# Altium project BC2087.PrjPcb (part 1 of 5)
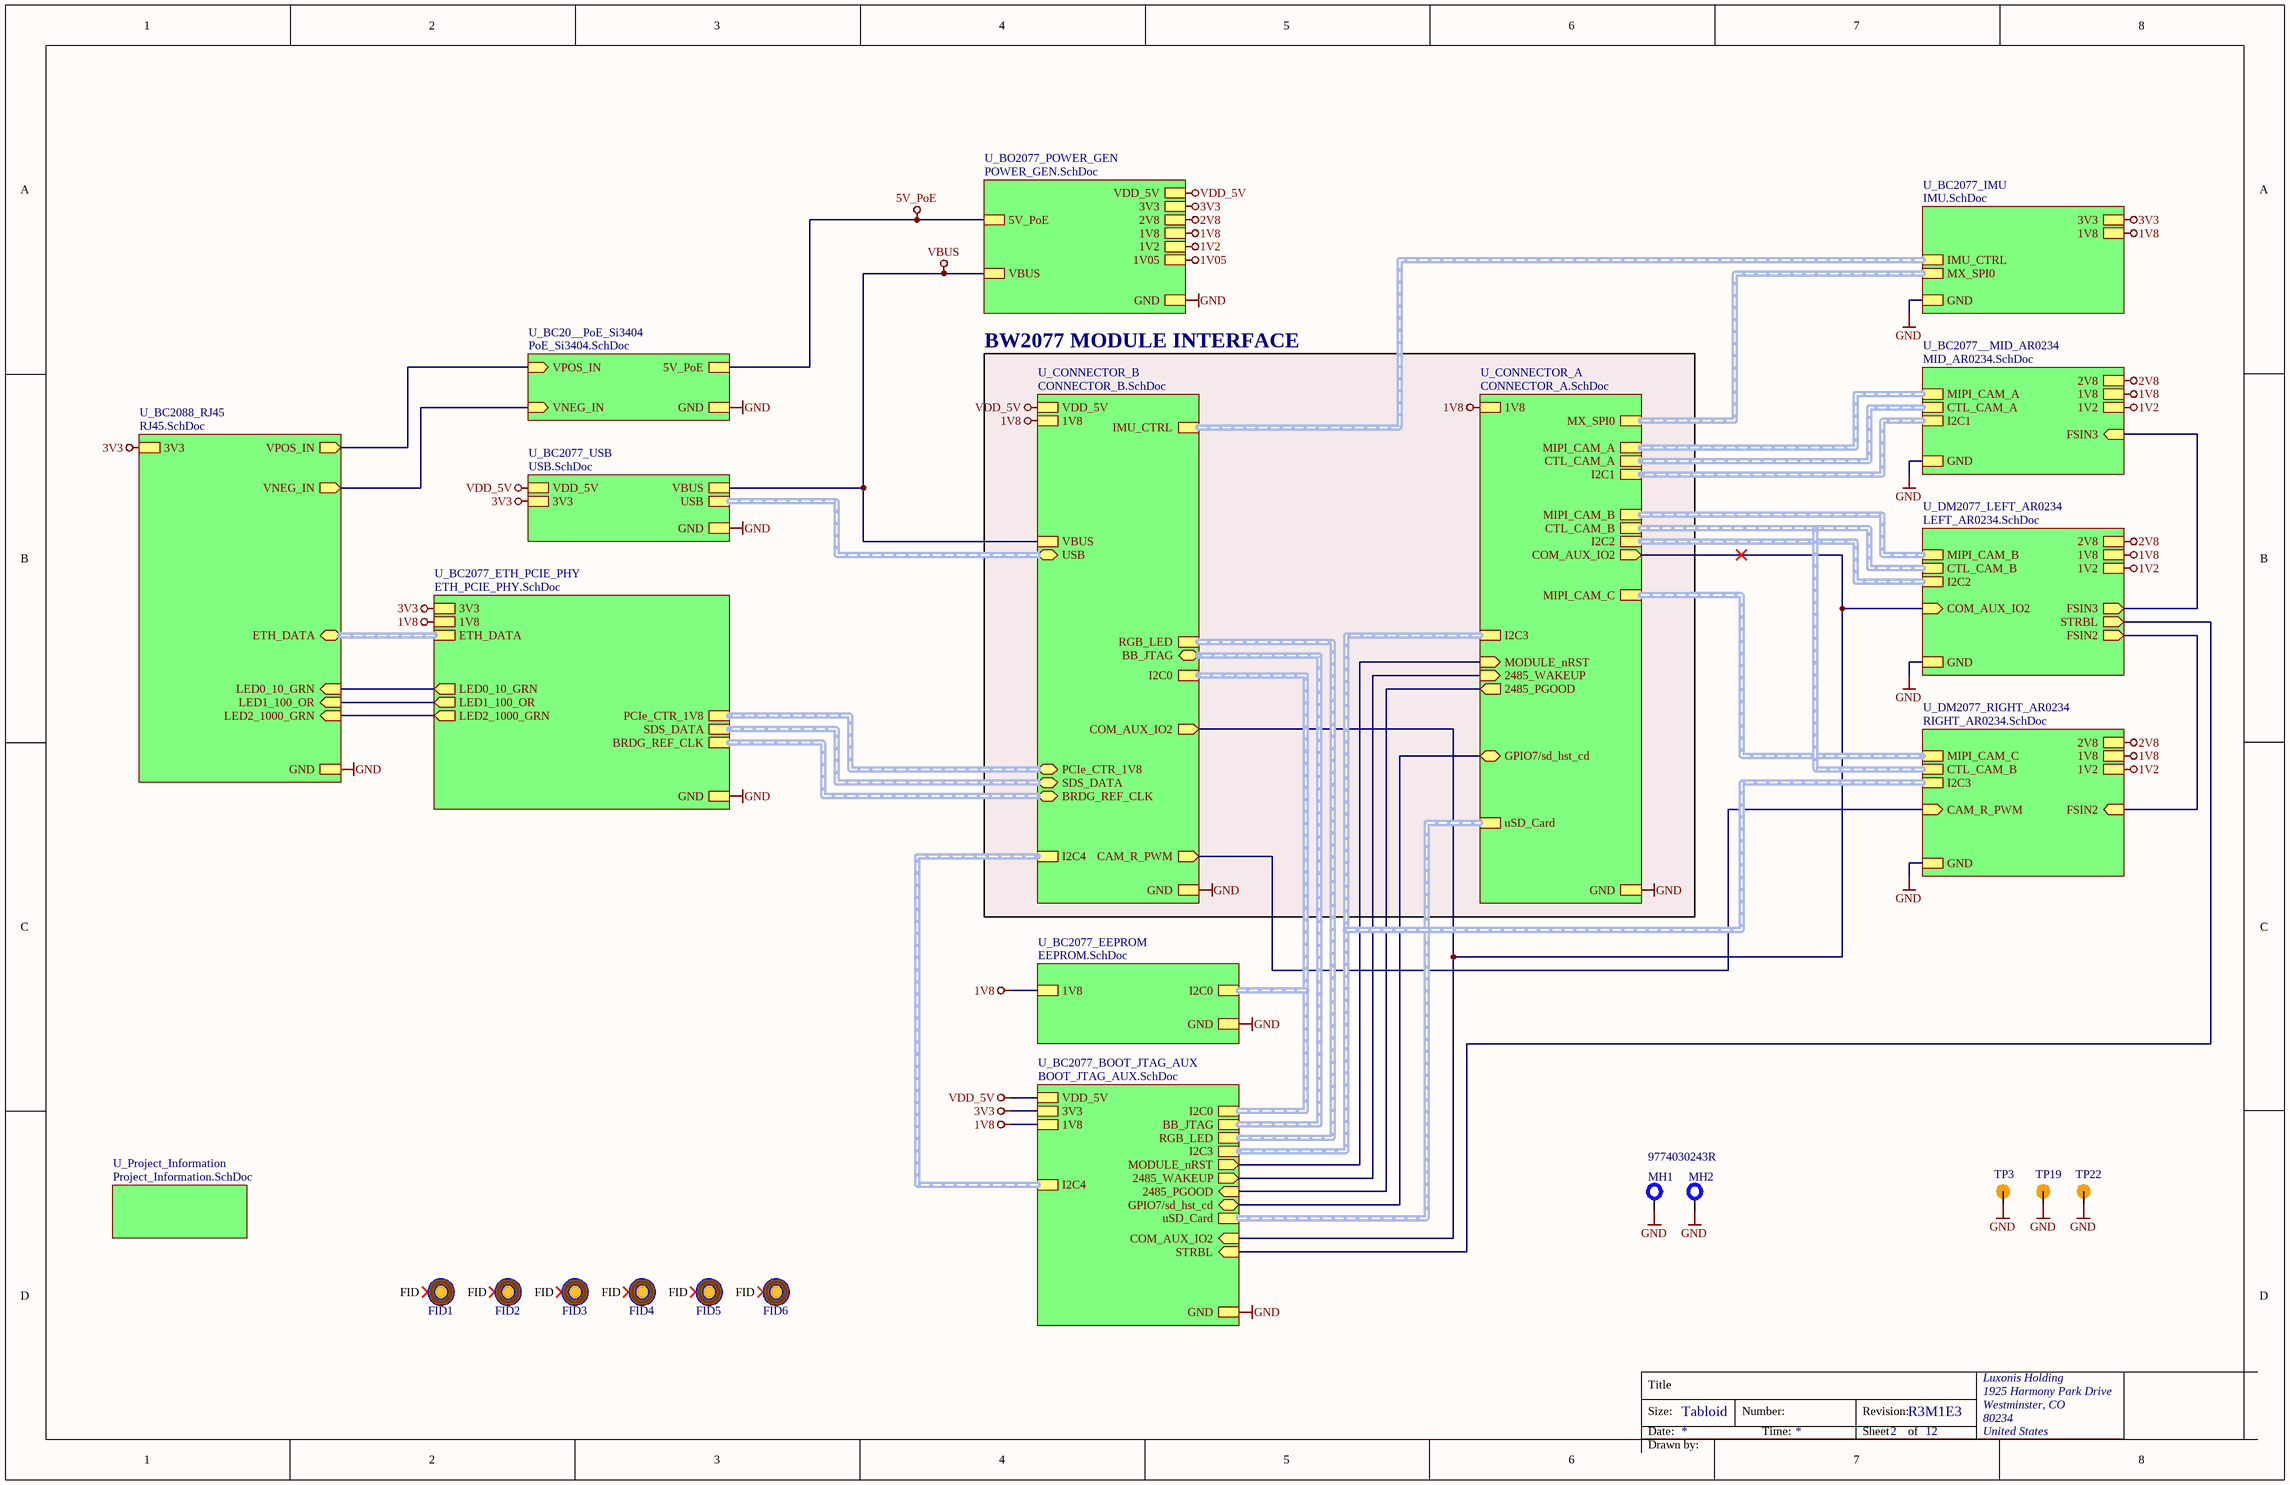
[diagram p0: TopLevel.SchDoc]
document_number: D2088000; drawn_by: Boris Chou / Blaz Kvas; project_title: BC2087; revision: R3M1E3
15 sheets, 302 parts. Net scope: strictly hierarchical (ports join the sheet entries above them; power ports are local).
Board file: BC2087.PcbDoc
Sheets:
  TopLevel.SchDoc
    U_Project_Information = Project_Information.SchDoc
    U_CONNECTOR_B = CONNECTOR_B.SchDoc
    U_CONNECTOR_A = CONNECTOR_A.SchDoc
    U_BC2077_ETH_PCIE_PHY = ETH_PCIE_PHY.SchDoc
    U_BC2088_RJ45 = RJ45.SchDoc
    U_BC2077_USB = USB.SchDoc
    U_BC2077_BOOT_JTAG_AUX = BOOT_JTAG_AUX.SchDoc
    U_BC20__PoE_Si3404 = PoE_Si3404.SchDoc
    U_BO2077_POWER_GEN = POWER_GEN.SchDoc
    U_BC2077__MID_AR0234 = MID_AR0234.SchDoc
    U_DM2077_RIGHT_AR0234 = RIGHT_AR0234.SchDoc
    U_DM2077_LEFT_AR0234 = LEFT_AR0234.SchDoc
    U_BC2077_IMU = IMU.SchDoc
    U_BC2077_EEPROM = EEPROM.SchDoc

## Sheet TopLevel.SchDoc: =project_title
size Tabloid; CompanyName: Luxonis Holding; DrawnBy: Boris Chou / Blaz Kvas; Organization: Luxonis Holding; Address1: 1925 Harmony Park Drive; Address2: Westminster, CO; Address3: 80234; Address4: United States; DocumentNumber: D2088000; Revision: R3M1E3; SheetNumber: 2; SheetTotal: 12

### Parts
FID1  FIDUCIAL  [FIDUCIAL_ROUND_1MM]  (value not drawn)  (no BOM)
FID2  FIDUCIAL  [FIDUCIAL_ROUND_1MM]  (value not drawn)  (no BOM)
FID3  FIDUCIAL  [FIDUCIAL_ROUND_1MM]  (value not drawn)  (no BOM)
FID4  FIDUCIAL  [FIDUCIAL_ROUND_1MM]  (value not drawn)  (no BOM)
FID5  FIDUCIAL  [FIDUCIAL_ROUND_1MM]  (value not drawn)  (no BOM)
FID6  FIDUCIAL  [FIDUCIAL_ROUND_1MM]  (value not drawn)  (no BOM)
MH1  9774030243R  [9774030243R]
MH2  9774030243R  [9774030243R]  (value not drawn)
TP3  TEST_POINT  [TP100_200_NS]  (value not drawn)  (no BOM)
TP19  TEST_POINT  [TP100_200_NS]  (value not drawn)  (no BOM)
TP22  TEST_POINT  [TP100_200_NS]  (value not drawn)  (no BOM)

### Sub-sheets
U_BC20__PoE_Si3404 = PoE_Si3404.SchDoc: 5V_PoE, GND, VPOS_IN (in), VNEG_IN (in)
U_BC2077__MID_AR0234 = MID_AR0234.SchDoc: 2V8, 1V2, I2C1 (harness I2C1), MIPI_CAM_A (harness MIPI_CAM_A), CTL_CAM_A (harness CTL_CAM_A), GND, 1V8, FSIN3 (in)
U_BC2077_BOOT_JTAG_AUX = BOOT_JTAG_AUX.SchDoc: RGB_LED (harness BOOT), BB_JTAG (harness BB_JTAG), uSD_Card (harness uSD_Card), 2485_WAKEUP (out), I2C3 (harness I2C3), MODULE_nRST (out), 2485_PGOOD (in), 1V8, 3V3, GND, VDD_5V, I2C0 (harness I2C0), GPIO7/sd_hst_cd (bidir), STRBL (in), COM_AUX_IO2 (in), I2C4 (harness I2C4)
U_BC2077_EEPROM = EEPROM.SchDoc: 1V8, GND, I2C0 (harness I2C0)
U_BC2077_ETH_PCIE_PHY = ETH_PCIE_PHY.SchDoc: ETH_DATA (harness ETH_DATA), LED0_10_GRN (out), LED1_100_OR (out), LED2_1000_GRN (out), SDS_DATA (harness Harness), 3V3, GND, BRDG_REF_CLK (harness BRDG_REF_CLK), 1V8, PCIe_CTR_1V8 (harness PCIe_CTR_1V8)
U_BC2077_IMU = IMU.SchDoc: GND, 3V3, 1V8, MX_SPI0 (harness MX_SPI0), IMU_CTRL (harness IMU_CTRL)
U_BC2077_USB = USB.SchDoc: USB (harness USB), GND, 3V3, VBUS, VDD_5V
U_BC2088_RJ45 = RJ45.SchDoc: GND, LED0_10_GRN (in), 3V3, LED2_1000_GRN (in), LED1_100_OR (in), VPOS_IN (out), VNEG_IN (out), ETH_DATA (bidir, harness ETH_DATA)
U_BO2077_POWER_GEN = POWER_GEN.SchDoc: GND, 3V3, 1V8, 5V_PoE, VBUS, 1V2, 2V8, 1V05, VDD_5V
U_CONNECTOR_A = CONNECTOR_A.SchDoc: I2C2 (harness I2C2), I2C1 (harness I2C1), uSD_Card (harness uSD_Card), MIPI_CAM_C (harness MIPI_CAM_C), CTL_CAM_A (harness CTL_CAM_A), MIPI_CAM_A (harness MIPI_CAM_A), MIPI_CAM_B (harness MIPI_CAM_B), GND, I2C3 (harness I2C3), CTL_CAM_B (harness CTL_CAM_B), COM_AUX_IO2 (out), MODULE_nRST (in), 2485_WAKEUP (in), 2485_PGOOD (out), GPIO7/sd_hst_cd (bidir), MX_SPI0 (harness MX_SPI0), 1V8
U_CONNECTOR_B = CONNECTOR_B.SchDoc: VBUS, I2C0 (harness I2C0), VDD_5V, GND, PCIe_CTR_1V8 (bidir, harness PCIe_CTR_1V8), BB_JTAG (bidir, harness BB_JTAG), USB (bidir, harness USB), SDS_DATA (bidir, harness Harness), BRDG_REF_CLK (bidir, harness BRDG_REF_CLK), IMU_CTRL (harness IMU_CTRL), RGB_LED (harness BOOT), 1V8, CAM_R_PWM (out), I2C4, COM_AUX_IO2 (out)
U_DM2077_LEFT_AR0234 = LEFT_AR0234.SchDoc: I2C2 (harness I2C2), CTL_CAM_B (harness CTL_CAM_B), MIPI_CAM_B (harness MIPI_CAM_B), 1V2, 2V8, GND, 1V8, FSIN2 (out), COM_AUX_IO2 (in), FSIN3 (out), STRBL (out)
U_DM2077_RIGHT_AR0234 = RIGHT_AR0234.SchDoc: MIPI_CAM_C (harness MIPI_CAM_C), I2C3 (harness I2C2), 1V2, 2V8, GND, 1V8, FSIN2 (in), CTL_CAM_B (harness CTL_CAM_B), CAM_R_PWM (in)
U_Project_Information = Project_Information.SchDoc: no entries

### Nets
1V2: sheet U_BO2077_POWER_GEN/1V2, sheet U_BC2077__MID_AR0234/1V2, sheet U_DM2077_RIGHT_AR0234/1V2, sheet U_DM2077_LEFT_AR0234/1V2
1V05: sheet U_BO2077_POWER_GEN/1V05
1V8: sheet U_CONNECTOR_B/1V8, sheet U_CONNECTOR_A/1V8, sheet U_BC2077_ETH_PCIE_PHY/1V8, sheet U_BC2077_BOOT_JTAG_AUX/1V8, sheet U_BO2077_POWER_GEN/1V8, sheet U_BC2077__MID_AR0234/1V8, sheet U_DM2077_RIGHT_AR0234/1V8, sheet U_DM2077_LEFT_AR0234/1V8, sheet U_BC2077_IMU/1V8, sheet U_BC2077_EEPROM/1V8
2V8: sheet U_BO2077_POWER_GEN/2V8, sheet U_BC2077__MID_AR0234/2V8, sheet U_DM2077_RIGHT_AR0234/2V8, sheet U_DM2077_LEFT_AR0234/2V8
3V3: sheet U_BC2077_ETH_PCIE_PHY/3V3, sheet U_BC2088_RJ45/3V3, sheet U_BC2077_USB/3V3, sheet U_BC2077_BOOT_JTAG_AUX/3V3, sheet U_BO2077_POWER_GEN/3V3, sheet U_BC2077_IMU/3V3
5V_PoE: sheet U_BC20__PoE_Si3404/5V_PoE, sheet U_BO2077_POWER_GEN/5V_PoE
GND: MH1.1 MH2.1 TP3.1 TP19.1 TP22.1 ; sheet U_CONNECTOR_B/GND, sheet U_CONNECTOR_A/GND, sheet U_BC2077_ETH_PCIE_PHY/GND, sheet U_BC2088_RJ45/GND, sheet U_BC2077_USB/GND, sheet U_BC2077_BOOT_JTAG_AUX/GND, sheet U_BC20__PoE_Si3404/GND, sheet U_BO2077_POWER_GEN/GND, sheet U_BC2077__MID_AR0234/GND, sheet U_DM2077_RIGHT_AR0234/GND, sheet U_DM2077_LEFT_AR0234/GND, sheet U_BC2077_IMU/GND, sheet U_BC2077_EEPROM/GND
VBUS: sheet U_CONNECTOR_B/VBUS, sheet U_BC2077_USB/VBUS, sheet U_BO2077_POWER_GEN/VBUS
VDD_5V: sheet U_CONNECTOR_B/VDD_5V, sheet U_BC2077_USB/VDD_5V, sheet U_BC2077_BOOT_JTAG_AUX/VDD_5V, sheet U_BO2077_POWER_GEN/VDD_5V
VNEG_IN: sheet U_BC2088_RJ45/VNEG_IN, sheet U_BC20__PoE_Si3404/VNEG_IN
2485_PGOOD: sheet U_CONNECTOR_A/2485_PGOOD, sheet U_BC2077_BOOT_JTAG_AUX/2485_PGOOD
2485_WAKEUP: sheet U_CONNECTOR_A/2485_WAKEUP, sheet U_BC2077_BOOT_JTAG_AUX/2485_WAKEUP
CAM_R_PWM: sheet U_CONNECTOR_B/CAM_R_PWM, sheet U_DM2077_RIGHT_AR0234/CAM_R_PWM
COM_AUX_IO2: sheet U_CONNECTOR_B/COM_AUX_IO2, sheet U_CONNECTOR_A/COM_AUX_IO2, sheet U_BC2077_BOOT_JTAG_AUX/COM_AUX_IO2, sheet U_DM2077_LEFT_AR0234/COM_AUX_IO2
FSIN2: sheet U_DM2077_RIGHT_AR0234/FSIN2, sheet U_DM2077_LEFT_AR0234/FSIN2
FSIN3: sheet U_BC2077__MID_AR0234/FSIN3, sheet U_DM2077_LEFT_AR0234/FSIN3
GPIO7/sd_hst_cd: sheet U_CONNECTOR_A/GPIO7/sd_hst_cd, sheet U_BC2077_BOOT_JTAG_AUX/GPIO7/sd_hst_cd
LED0_10_GRN: sheet U_BC2077_ETH_PCIE_PHY/LED0_10_GRN, sheet U_BC2088_RJ45/LED0_10_GRN
LED1_100_OR: sheet U_BC2077_ETH_PCIE_PHY/LED1_100_OR, sheet U_BC2088_RJ45/LED1_100_OR
LED2_1000_GRN: sheet U_BC2077_ETH_PCIE_PHY/LED2_1000_GRN, sheet U_BC2088_RJ45/LED2_1000_GRN
MODULE_nRST: sheet U_CONNECTOR_A/MODULE_nRST, sheet U_BC2077_BOOT_JTAG_AUX/MODULE_nRST
STRBL: sheet U_BC2077_BOOT_JTAG_AUX/STRBL, sheet U_DM2077_LEFT_AR0234/STRBL
VPOS_IN: sheet U_BC2088_RJ45/VPOS_IN, sheet U_BC20__PoE_Si3404/VPOS_IN

Not connected (* = marked no-connect by the designer): FID1 FID*; FID2 FID*; FID3 FID*; FID4 FID*; FID5 FID*; FID6 FID*

### Buses and harness runs
harness sheet U_BC2077__MID_AR0234/CTL_CAM_A = sheet U_CONNECTOR_A/CTL_CAM_A
harness sheet U_BC2077__MID_AR0234/I2C1 = sheet U_CONNECTOR_A/I2C1
harness sheet U_BC2077__MID_AR0234/MIPI_CAM_A = sheet U_CONNECTOR_A/MIPI_CAM_A
harness sheet U_BC2077_BOOT_JTAG_AUX/BB_JTAG = sheet U_CONNECTOR_B/BB_JTAG
harness sheet U_BC2077_BOOT_JTAG_AUX/I2C0 = sheet U_BC2077_EEPROM/I2C0 = sheet U_CONNECTOR_B/I2C0
harness sheet U_BC2077_BOOT_JTAG_AUX/I2C3 = sheet U_CONNECTOR_A/I2C3 = sheet U_DM2077_RIGHT_AR0234/I2C3
harness sheet U_BC2077_BOOT_JTAG_AUX/I2C4 = sheet U_CONNECTOR_B/I2C4
harness sheet U_BC2077_BOOT_JTAG_AUX/RGB_LED = sheet U_CONNECTOR_B/RGB_LED
harness sheet U_BC2077_BOOT_JTAG_AUX/uSD_Card = sheet U_CONNECTOR_A/uSD_Card
harness sheet U_BC2077_ETH_PCIE_PHY/BRDG_REF_CLK = sheet U_CONNECTOR_B/BRDG_REF_CLK
harness sheet U_BC2077_ETH_PCIE_PHY/ETH_DATA = sheet U_BC2088_RJ45/ETH_DATA
harness sheet U_BC2077_ETH_PCIE_PHY/PCIe_CTR_1V8 = sheet U_CONNECTOR_B/PCIe_CTR_1V8
harness sheet U_BC2077_ETH_PCIE_PHY/SDS_DATA = sheet U_CONNECTOR_B/SDS_DATA
harness sheet U_BC2077_IMU/IMU_CTRL = sheet U_CONNECTOR_B/IMU_CTRL
harness sheet U_BC2077_IMU/MX_SPI0 = sheet U_CONNECTOR_A/MX_SPI0
harness sheet U_BC2077_USB/USB = sheet U_CONNECTOR_B/USB
harness sheet U_CONNECTOR_A/CTL_CAM_B = sheet U_DM2077_LEFT_AR0234/CTL_CAM_B = sheet U_DM2077_RIGHT_AR0234/CTL_CAM_B
harness sheet U_CONNECTOR_A/I2C2 = sheet U_DM2077_LEFT_AR0234/I2C2
harness sheet U_CONNECTOR_A/MIPI_CAM_B = sheet U_DM2077_LEFT_AR0234/MIPI_CAM_B
harness sheet U_CONNECTOR_A/MIPI_CAM_C = sheet U_DM2077_RIGHT_AR0234/MIPI_CAM_C

### Notes on the sheet
- BW2077 MODULE INTERFACE
- Title
- Size:
- Date:
- Tabloid
- Number:
- Time:
- Revision:
- Sheet
- of
- Drawn by:

### Library data of the parts
FID1-FID6 = CMP-011-000000-4: Fiducial with various available footprints; Manufacturer Part Number 1: /
MH1 MH2 = CMP-120-000000-2: MP ROUND STANDOFF M2X0.4 STEEL 3MM; Manufacturer 1: Wurth Electronics; Manufacturer Part Number 1: 9774030243R
TP3 TP19 TP22 = CMP-015-000000-2: Manufacturer Part Number 1: /; Design Item ID: TEST_POINT; Source: LuxonisMaster.SchLib

## Sheet Project_Information.SchDoc: =project_title
size Tabloid; CompanyName: Luxonis Holding; DrawnBy: Boris Chou / Blaz Kvas; Organization: Luxonis Holding; Address1: 1925 Harmony Park Drive; Address2: Westminster, CO; Address3: 80234; Address4: United States; DocumentNumber: D2088000; Revision: R3M1E3; SheetNumber: 1; SheetTotal: 12
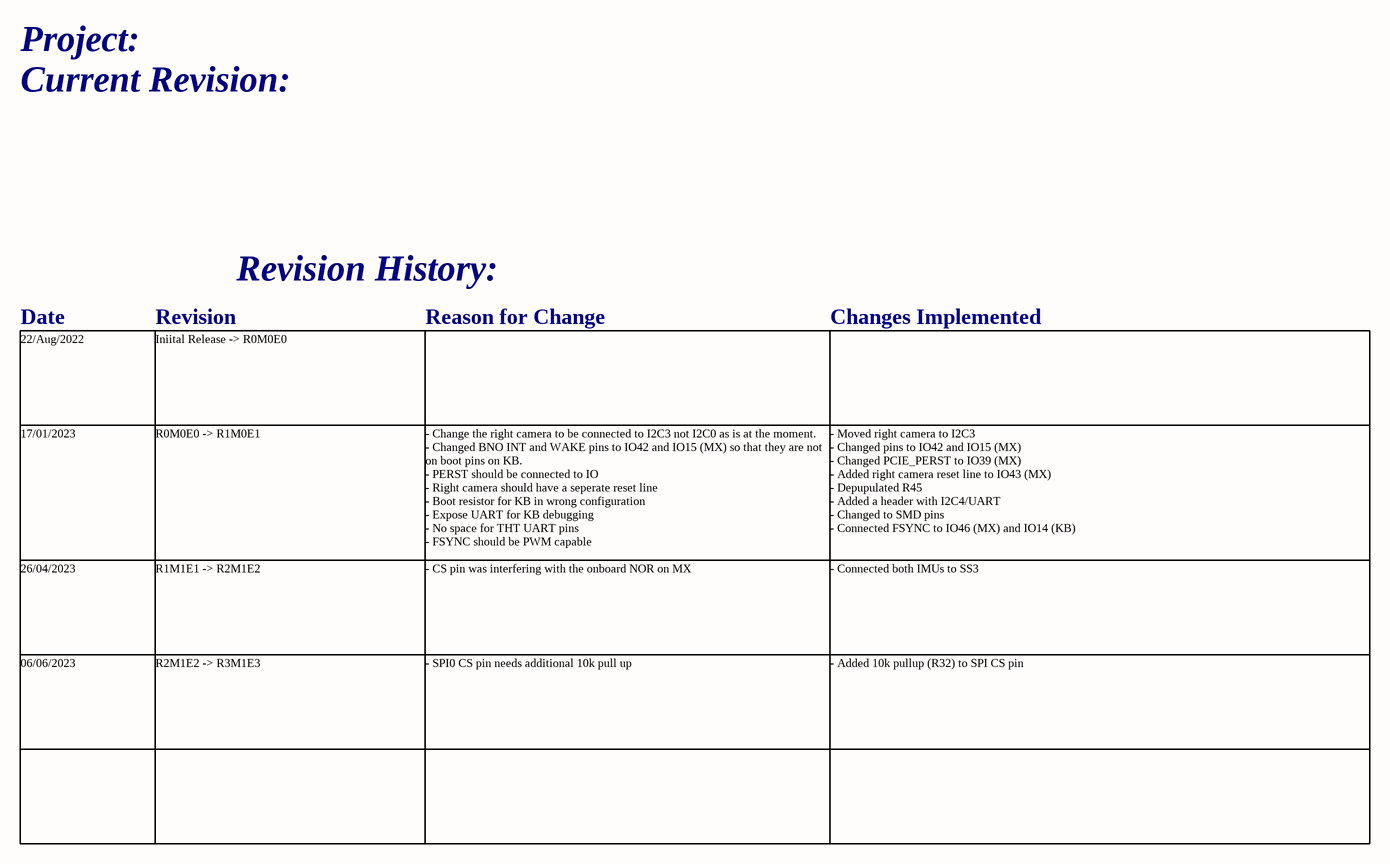
[diagram p1: Project_Information.SchDoc]

### Notes on the sheet
- Project:
- Current Revision:
- Revision History:
- Date
- Revision
- Reason for Change
- Changes Implemented
- 22/Aug/2022
- Iniital Release -> R0M0E0
- 17/01/2023
- R0M0E0 -> R1M0E1
- - Change the right camera to be connected to I2C3 not I2C0 as is at the moment.
  - Changed BNO INT and WAKE pins to IO42 and IO15 (MX) so that they are not on boot pins on KB.
  - PERST should be connected to IO
  - Right camera should have a seperate reset line
  - Boot resistor for KB in wrong configuration
  - Expose UART for KB debugging
  - No space for THT UART pins
  - FSYNC should be PWM capable
- - Moved right camera to I2C3
  - Changed pins to IO42 and IO15 (MX)
  - Changed PCIE_PERST to IO39 (MX)
  - Added right camera reset line to IO43 (MX)
  - Depupulated R45
  - Added a header with I2C4/UART
  - Changed to SMD pins
  - Connected FSYNC to IO46 (MX) and IO14 (KB)
- 26/04/2023
- R1M1E1 -> R2M1E2
- - CS pin was interfering with the onboard NOR on MX
- - Connected both IMUs to SS3
- 06/06/2023
- R2M1E2 -> R3M1E3
- - SPI0 CS pin needs additional 10k pull up
- - Added 10k pullup (R32) to SPI CS pin
- Title
- Size:
- Date:
- Tabloid
- Number:
- Time:
- Revision:
- Sheet
- of
- Drawn by:

## Sheet CONNECTOR_B.SchDoc: =project_title
size Tabloid; CompanyName: Luxonis Holding; DrawnBy: Boris Chou / Blaz Kvas; Organization: Luxonis Holding; Address1: 1925 Harmony Park Drive; Address2: Westminster, CO; Address3: 80234; Address4: United States; DocumentNumber: D2088000; Revision: R3M1E3; SheetNumber: 6; SheetTotal: 12
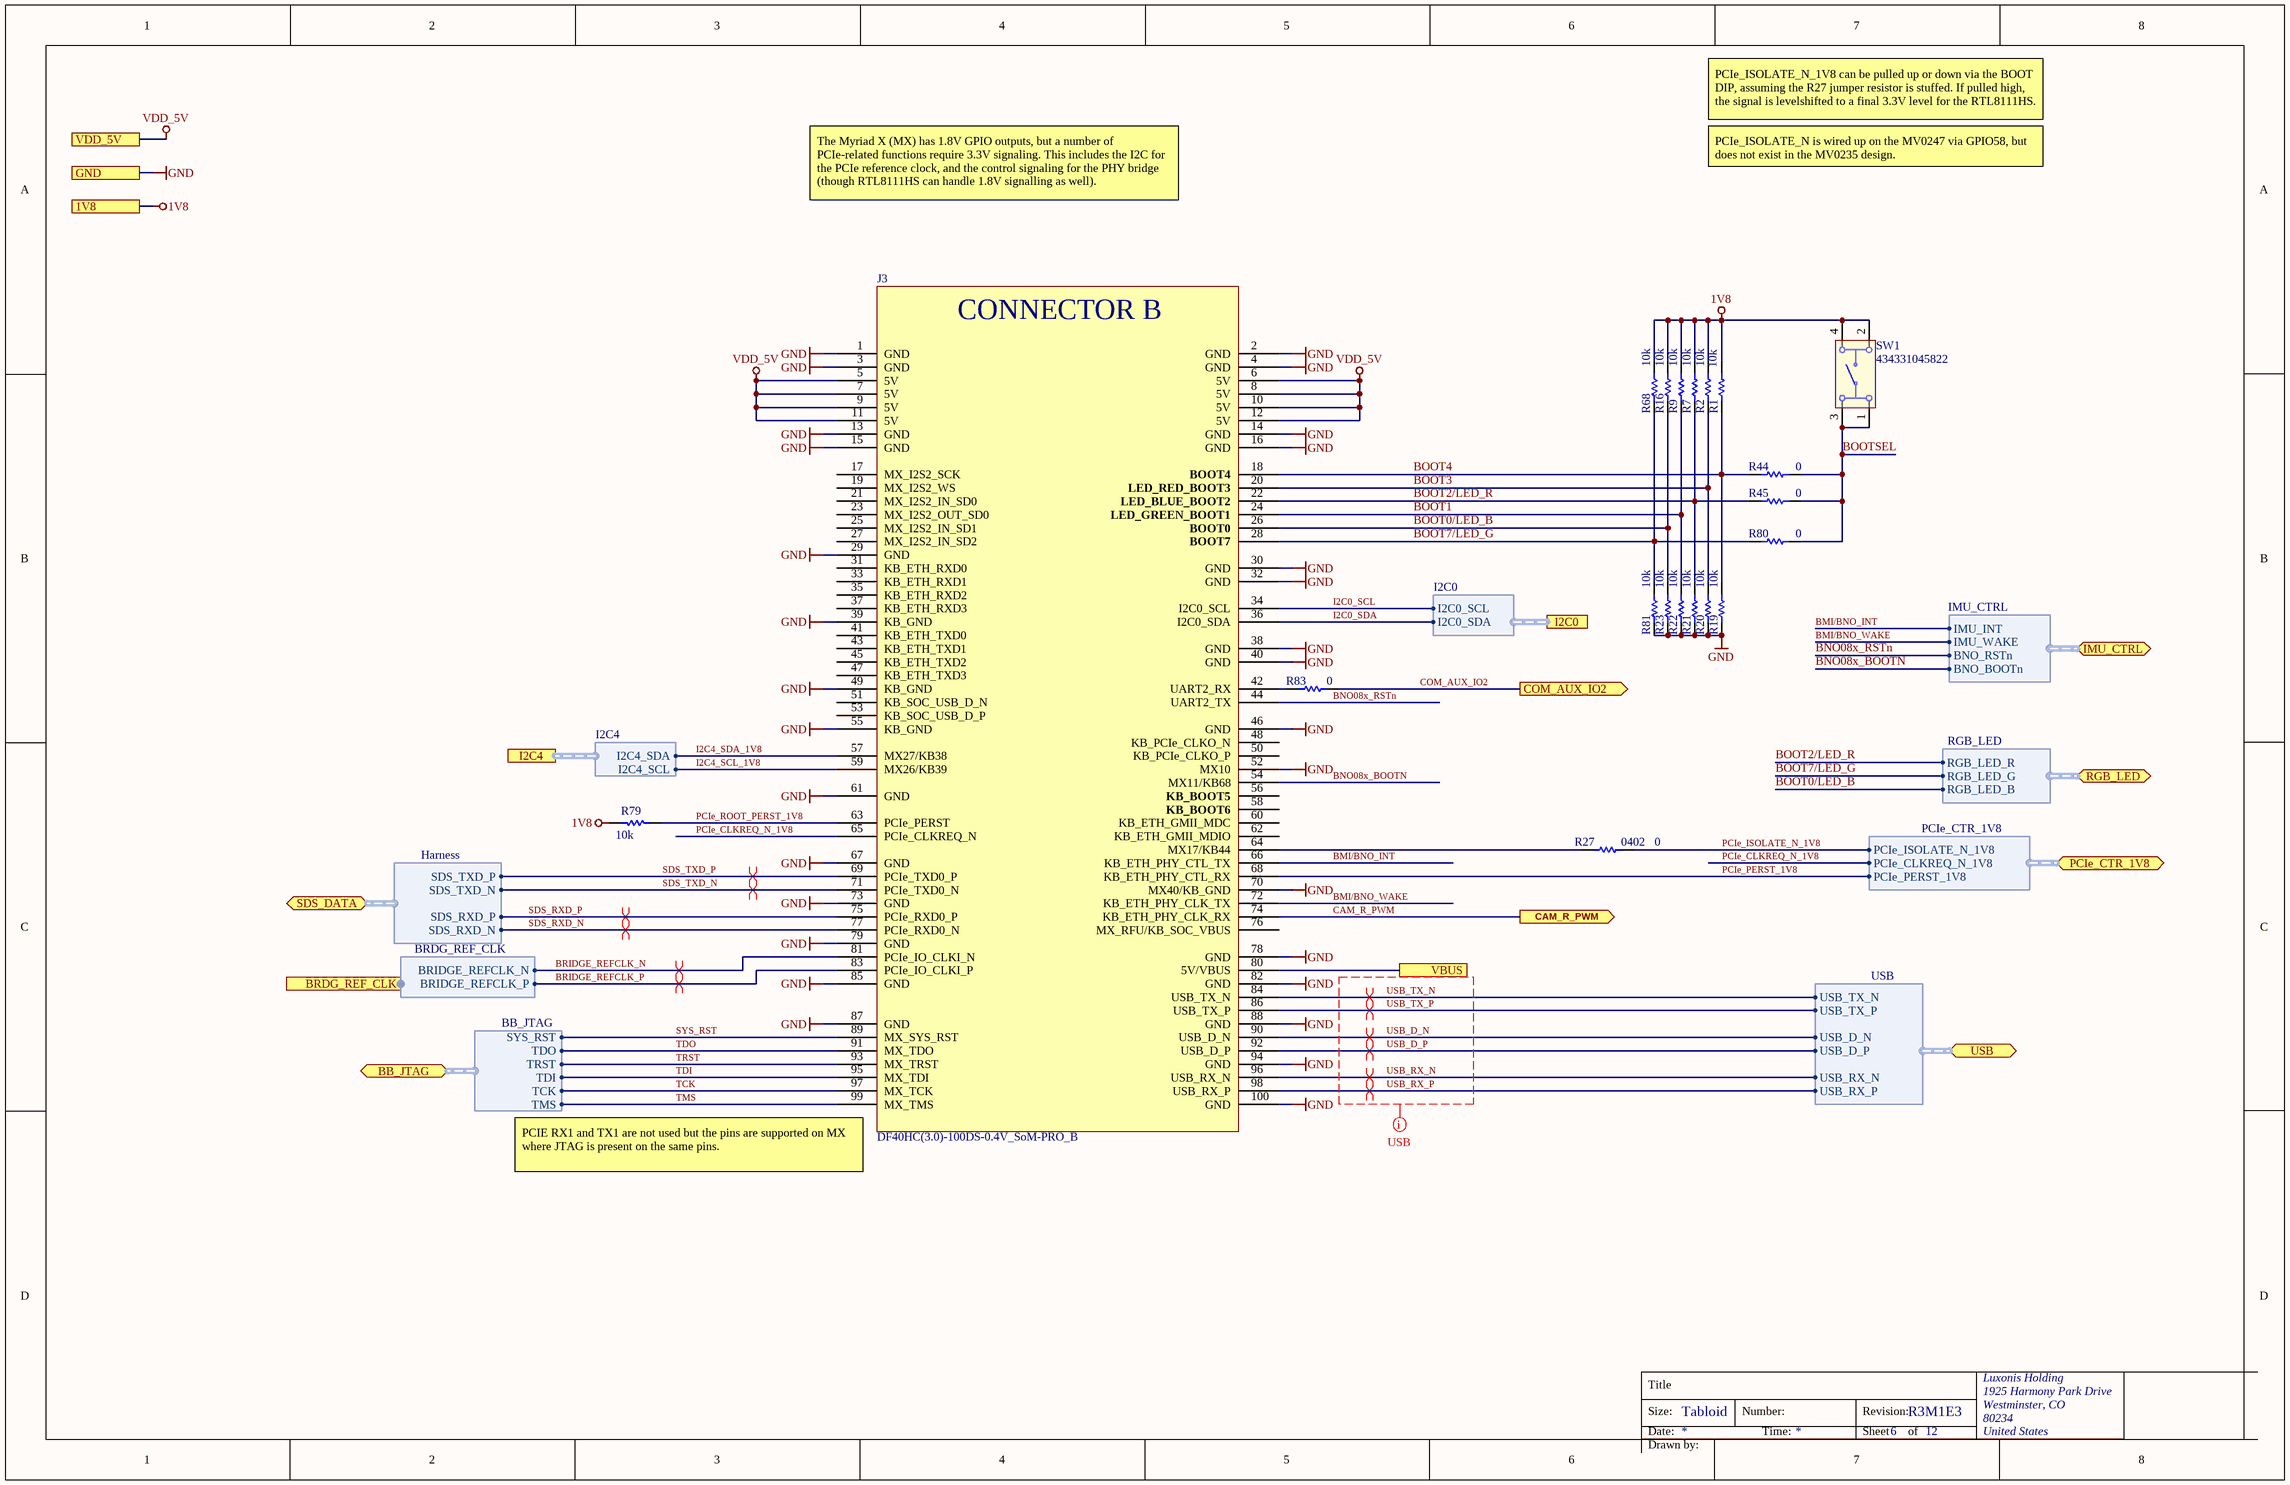
[diagram p2: CONNECTOR_B.SchDoc]

### Parts
J3  DF40HC(3.0)-100DS-0.4V_SoM-PRO_B  [CON_B_BW2099_SoM_DF40HC-3.0-100DS-0.4V_minpad]
R1  value 10k  [RESC0402(1005)_L]  (hidden comment: RC0402FR-1310KL)
R2  value 10k  [RESC0402(1005)_L]  (hidden comment: RC0402FR-1310KL)
R7  value 10k  [RESC0402(1005)_L]  (hidden comment: RC0402FR-1310KL)
R9  value 10k  [RESC0402(1005)_L]  (hidden comment: RC0402FR-1310KL)
R16  value 10k  [RESC0402(1005)_L]  (hidden comment: RC0402FR-1310KL)
R19  value 10k  [RESC0402(1005)_L]  (hidden comment: RC0402FR-1310KL)
R20  value 10k  [RESC0402(1005)_L]  (hidden comment: RC0402FR-1310KL)
R21  value 10k  [RESC0402(1005)_L]  (hidden comment: RC0402FR-1310KL)
R22  value 10k  [RESC0402(1005)_L]  (hidden comment: RC0402FR-1310KL)
R23  value 10k  [RESC0402(1005)_L]  (hidden comment: RC0402FR-1310KL)
R27  value 0  Case/Package: 0402  [RESC0402(1005)_L]  (hidden comment: CRCW04020000Z0ED)
R44  value 0  [RESC0402(1005)_L]  (hidden comment: CRCW04020000Z0ED)
R45  value 0  [RESC0402(1005)_L]  (hidden comment: CRCW04020000Z0ED)
R68  value 10k  [RESC0402(1005)_L]  (hidden comment: RC0402FR-1310KL)
R79  value 10k  [RESC0402(1005)_N]  (hidden comment: RC0402FR-1310KL)
R80  value 0  [RESC0402(1005)_L]  (hidden comment: CRCW04020000Z0ED)
R81  value 10k  [RESC0402(1005)_L]  (hidden comment: RC0402FR-1310KL)
R83  value 0  [RESC0402(1005)_L]  (hidden comment: CRCW04020000Z0ED)
SW1  434331045822  [434331045822]

### Ports
1V8, BB_JTAG (bidir, harness BB_JTAG), BRDG_REF_CLK (harness BRDG_REF_CLK), CAM_R_PWM (out), COM_AUX_IO2 (out), GND, I2C0 (harness I2C0), I2C4 (harness I2C4), IMU_CTRL (bidir, harness IMU_CTRL), PCIe_CTR_1V8 (bidir, harness PCIe_CTR_1V8), RGB_LED (bidir, harness RGB_LED), SDS_DATA (bidir, harness Harness), USB (bidir, harness USB), VBUS, VDD_5V

### Harnesses
USB: USB_RX_P, USB_RX_N, USB_D_P, USB_D_N, USB_TX_P, USB_TX_N
I2C0: I2C0_SDA, I2C0_SCL
BB_JTAG: SYS_RST, TDO, TRST, TDI, TCK, TMS
Harness: SDS_TXD_P, SDS_TXD_N, SDS_RXD_P, SDS_RXD_N
PCIe_CTR_1V8: PCIe_CLKREQ_N_1V8, PCIe_ISOLATE_N_1V8, PCIe_PERST_1V8
BRDG_REF_CLK: BRIDGE_REFCLK_P, BRIDGE_REFCLK_N
RGB_LED: RGB_LED_G, RGB_LED_B, RGB_LED_R
I2C4: I2C4_SDA, I2C4_SCL
IMU_CTRL: IMU_INT, IMU_WAKE, BNO_RSTn, BNO_BOOTn

### Nets
1V8: R1.2 R2.2 R7.2 R9.2 R16.2 R68.2 R79.1 SW1.2 SW1.4 ; port 1V8
GND: J3.1(GND) J3.2(GND) J3.3(GND) J3.4(GND) J3.13(GND) J3.14(GND) J3.15(GND) J3.16(GND) J3.29(GND) J3.30(GND) J3.32(GND) J3.38(GND) J3.39(KB_GND) J3.40(GND) J3.46(GND) J3.49(KB_GND) J3.52(MX10) J3.55(KB_GND) J3.61(GND) J3.67(GND) J3.70(MX40/KB_GND) J3.73(GND) J3.78(GND) J3.79(GND) J3.82(GND) J3.85(GND) J3.87(GND) J3.88(GND) J3.94(GND) J3.100(GND) R19.1 R20.1 R21.1 R22.1 R23.1 R81.1 ; port GND
VBUS: J3.80(5V/VBUS) ; port VBUS
VDD_5V: J3.5(5V) J3.6(5V) J3.7(5V) J3.8(5V) J3.9(5V) J3.10(5V) J3.11(5V) J3.12(5V) ; port VDD_5V
BMI/BNO_INT: J3.66(KB_ETH_PHY_CTL_TX) ; port IMU_CTRL.IMU_INT
BMI/BNO_WAKE: J3.72(KB_ETH_PHY_CLK_TX) ; port IMU_CTRL.IMU_WAKE
BNO08x_BOOTN: J3.54(MX11/KB68) ; port IMU_CTRL.BNO_BOOTn
BNO08x_RSTn: J3.44(UART2_TX) ; port IMU_CTRL.BNO_RSTn
BOOT0/LED_B: J3.26(BOOT0) R16.1 R23.2 ; port RGB_LED.RGB_LED_B
BOOT1: J3.24(LED_GREEN_BOOT1) R9.1 R22.2
BOOT2/LED_R: J3.22(LED_BLUE_BOOT2) R7.1 R21.2 R45.2 ; port RGB_LED.RGB_LED_R
BOOT3: J3.20(LED_RED_BOOT3) R2.1 R20.2
BOOT4: J3.18(BOOT4) R1.1 R19.2 R44.2
BOOT7/LED_G: J3.28(BOOT7) R68.1 R80.2 R81.2 ; port RGB_LED.RGB_LED_G
BOOTSEL: R44.1 R45.1 R80.1 SW1.1 SW1.3
BRIDGE_REFCLK_N: J3.81(PCIe_IO_CLKI_N) ; port BRDG_REF_CLK.BRIDGE_REFCLK_N
BRIDGE_REFCLK_P: J3.83(PCIe_IO_CLKI_P) ; port BRDG_REF_CLK.BRIDGE_REFCLK_P
CAM_R_PWM: J3.74(KB_ETH_PHY_CLK_RX) ; port CAM_R_PWM
COM_AUX_IO2: R83.1 ; port COM_AUX_IO2
I2C0_SCL: J3.34(I2C0_SCL) ; port I2C0.I2C0_SCL
I2C0_SDA: J3.36(I2C0_SDA) ; port I2C0.I2C0_SDA
I2C4_SCL_1V8: J3.59(MX26/KB39) ; port I2C4.I2C4_SCL
I2C4_SDA_1V8: J3.57(MX27/KB38) ; port I2C4.I2C4_SDA
PCIe_CLKREQ_N_1V8: J3.65(PCIe_CLKREQ_N) ; port PCIe_CTR_1V8.PCIe_CLKREQ_N_1V8
PCIe_ISOLATE_N_1V8: R27.2 ; port PCIe_CTR_1V8.PCIe_ISOLATE_N_1V8
PCIe_PERST_1V8: J3.68(KB_ETH_PHY_CTL_RX) ; port PCIe_CTR_1V8.PCIe_PERST_1V8
PCIe_ROOT_PERST_1V8: J3.63(PCIe_PERST) R79.2
SDS_RXD_N: J3.77(PCIe_RXD0_N) ; port SDS_DATA.SDS_RXD_N
SDS_RXD_P: J3.75(PCIe_RXD0_P) ; port SDS_DATA.SDS_RXD_P
SDS_TXD_N: J3.71(PCIe_TXD0_N) ; port SDS_DATA.SDS_TXD_N
SDS_TXD_P: J3.69(PCIe_TXD0_P) ; port SDS_DATA.SDS_TXD_P
SYS_RST: J3.89(MX_SYS_RST) ; port BB_JTAG.SYS_RST
TCK: J3.97(MX_TCK) ; port BB_JTAG.TCK
TDI: J3.95(MX_TDI) ; port BB_JTAG.TDI
TDO: J3.91(MX_TDO) ; port BB_JTAG.TDO
TMS: J3.99(MX_TMS) ; port BB_JTAG.TMS
TRST: J3.93(MX_TRST) ; port BB_JTAG.TRST
USB_D_N: J3.90(USB_D_N) ; port USB.USB_D_N
USB_D_P: J3.92(USB_D_P) ; port USB.USB_D_P
USB_RX_N: J3.96(USB_RX_N) ; port USB.USB_RX_N
USB_RX_P: J3.98(USB_RX_P) ; port USB.USB_RX_P
USB_TX_N: J3.84(USB_TX_N) ; port USB.USB_TX_N
USB_TX_P: J3.86(USB_TX_P) ; port USB.USB_TX_P
NetJ3_42: J3.42(UART2_RX) R83.2
NetJ3_64: J3.64(MX17/KB44) R27.1

Not connected (* = marked no-connect by the designer): J3 17(MX_I2S2_SCK) 19(MX_I2S2_WS) 21(MX_I2S2_IN_SD0) 23(MX_I2S2_OUT_SD0) 25(MX_I2S2_IN_SD1) 27(MX_I2S2_IN_SD2) 31(KB_ETH_RXD0) 33(KB_ETH_RXD1) 35(KB_ETH_RXD2) 37(KB_ETH_RXD3) 41(KB_ETH_TXD0) 43(KB_ETH_TXD1) 45(KB_ETH_TXD2) 47(KB_ETH_TXD3) 48(KB_PCIe_CLKO_N) 50(KB_PCIe_CLKO_P) 51(KB_SOC_USB_D_N) 53(KB_SOC_USB_D_P) 56(KB_BOOT5) 58(KB_BOOT6) 60(KB_ETH_GMII_MDC) 62(KB_ETH_GMII_MDIO) 76(MX_RFU/KB_SOC_VBUS)

### Layout directives
net class USB: USB_D_N, USB_D_P, USB_RX_N, USB_RX_P, USB_TX_N, USB_TX_P
differential pair; differential pair class 100ohm: BRIDGE_REFCLK_N, BRIDGE_REFCLK_P, SDS_RXD_N, SDS_RXD_P, SDS_TXD_N, SDS_TXD_P
differential pair; differential pair class USB3: USB_D_N, USB_D_P, USB_RX_N, USB_RX_P, USB_TX_N, USB_TX_P

### Notes on the sheet
- PCIe_ISOLATE_N_1V8 can be pulled up or down via the BOOT DIP, assuming the R27 jumper resistor is stuffed. If pulled high, the signal is levelshifted to a final 3.3V level for the RTL8111HS.
- PCIe_ISOLATE_N is wired up on the MV0247 via GPIO58, but does not exist in the MV0235 design.
- The Myriad X (MX) has 1.8V GPIO outputs, but a number of PCIe-related functions require 3.3V signaling. This includes the I2C for the PCIe reference clock, and the control signaling for the PHY bridge (though RTL8111HS can handle 1.8V signalling as well).
- (near J3) PCIE RX1 and TX1 are not used but the pins are supported on MX where JTAG is present on the same pins.
- Title
- Size:
- Date:
- Tabloid
- Number:
- Time:
- Revision:
- Sheet
- of
- Drawn by:
- (in symbol CMP-002-00155-6) CONNECTOR B

### Library data of the parts
J3 = CMP-002-00155-6: OAK-SoM-Pro_S2/S3 base board conn. B; Manufacturer Part Number 1: DF40HC(3.0)-100DS-0.4V(58); Manufacturer 1: Hirose; Number of Positions: 100; Connector Type: Receptacle; System: Connector; Gender: Female; Pitch: 0.016inch; ComponentLink4Description: https://datasheet.ciiva.com/18562/ed-df40-20140305-18562462.pdf?src-supplier=Digi-Key; ComponentLink2Description: https://datasheet.ciiva.com/18562/ed-df40-20140305-18562189.pdf?src-supplier=Digi-Key; ComponentLink4URL: https://datasheet.ciiva.com/18562/ed-df40-20140305-18562462.pdf?src-supplier=Digi-Key; ComponentLink2URL: https://datasheet.ciiva.com/18562/ed-df40-20140305-18562189.pdf?src-supplier=Digi-Key; Pins: 100; Lead Free: Lead Free; Package Quantity: 1000; Stock 2: 2078; Mount: Surface Mount; ComponentLink1URL: https://datasheet.ciiva.com/46636/ed-df40-20140305-46636517.pdf?src-supplier=Digi-Key; ComponentLink3URL: https://datasheet.ciiva.com/13559/ed-df40-20140305-13559540.pdf?src-supplier=Mouser; ComponentLink3Description: https://datasheet.ciiva.com/13559/ed-df40-20140305-13559540.pdf?src-supplier=Mouser; Pricing 2: 1=2.50000, 10=2.40000, 25=2.10000, 50=2.10000, 100=2.00000, 250=1.76000, 500=1.71000, 1000=1.45000, 2000=1.36000, 5000=1.31000, 10000=1.31000 (USD); Design Item ID: DF40HC(3.0)-100DS-0.4V_SoM-PRO_B; ComponentLink1Description: https://datasheet.ciiva.com/46636/ed-df40-20140305-46636517.pdf?src-supplier=Digi-Key; Mounting Technology: SMT; RoHS: Yes; Stock 1: 2172; Pricing 1: 1=2.54000, 10=2.26000, 25=2.07000, 50=2.07000, 100=1.98000, 250=1.79000, 500=1.65000, 1000=1.41000, 3000=1.32000, 6000=1.23000, 10000=1.23000 (USD); Number of Rows: 2; Contact Plating: Gold; Packaging: Tape and Reel; Source: LuxonisMaster.SchLib
R1 R2 R7 R9 R16 R19-R23 R68 R81 = CMP-115-000004-7: RES SMD 10K OHM 1% 1/16W 0402; Manufacturer 1: Yageo; Temperature Coefficient: 100ppm/°C; Power Rating: 62.5mW; Voltage Rating: 50V; Manufacturer Part Number 1: RC0402FR-1310KL; Case/Package: 0402; Min Operating Temperature: -55°C; Max Operating Temperature: 155°C; Tolerance: 1%; Design Item ID: RC0402FR-1310KL
R27 = CMP-013-000022-11: RES SMD 0 OHM 5% 1/16W 0402; Manufacturer 1: Vishay; Power Rating: 63mW; Voltage Rating: 50V; Manufacturer Part Number 1: CRCW04020000Z0ED; Min Operating Temperature: -55°C; Max Operating Temperature: 155°C; Tolerance: 5%; Design Item ID: CRCW04020000Z0ED
R44 R45 R80 R83 = CMP-013-000022-10: RES SMD 0 OHM 5% 1/16W 0402; Manufacturer 1: Vishay; Power Rating: 63mW; Voltage Rating: 50V; Manufacturer Part Number 1: CRCW04020000Z0ED; Case/Package: 0402; Min Operating Temperature: -55°C; Max Operating Temperature: 155°C; Tolerance: 5%; Design Item ID: CRCW04020000Z0ED
R79 = CMP-115-000004-8: RES SMD 10K OHM 1% 1/16W 0402; Manufacturer 1: Yageo; Temperature Coefficient: 100ppm/°C; Power Rating: 62.5mW; Voltage Rating: 50V; Manufacturer Part Number 1: RC0402FR-1310KL; Case/Package: 0402; Min Operating Temperature: -55°C; Max Operating Temperature: 155°C; Tolerance: 1%; Design Item ID: RC0402FR-1310KL
SW1 = CMP-011-00016-3: Keypad Switch, 1 Switches, SPST, Momentary-tactile, 0.05A, 12VDC, 2.65N, Solder Terminal, Surface Mount-right Angle; Manufacturer 1: Wurth Electronics; Voltage Rating: 12V; Max Current Rating: 50mA; Throw Configuration: SPST-NO; Supplier Part Number 1: 732-7055-2-ND; Manufacturer part number 1: 434331045822; Pins: 4; Supplier 1: Digi-Key; Current Rating: 50mA; Mounting Technology: SMD; Case/Package: 434331045822

## Sheet CONNECTOR_A.SchDoc: =project_title
size Tabloid; CompanyName: Luxonis Holding; DrawnBy: Boris Chou / Blaz Kvas; Organization: Luxonis Holding; Address1: 1925 Harmony Park Drive; Address2: Westminster, CO; Address3: 80234; Address4: United States; DocumentNumber: D2088000; Revision: R3M1E3; SheetNumber: 5; SheetTotal: 12
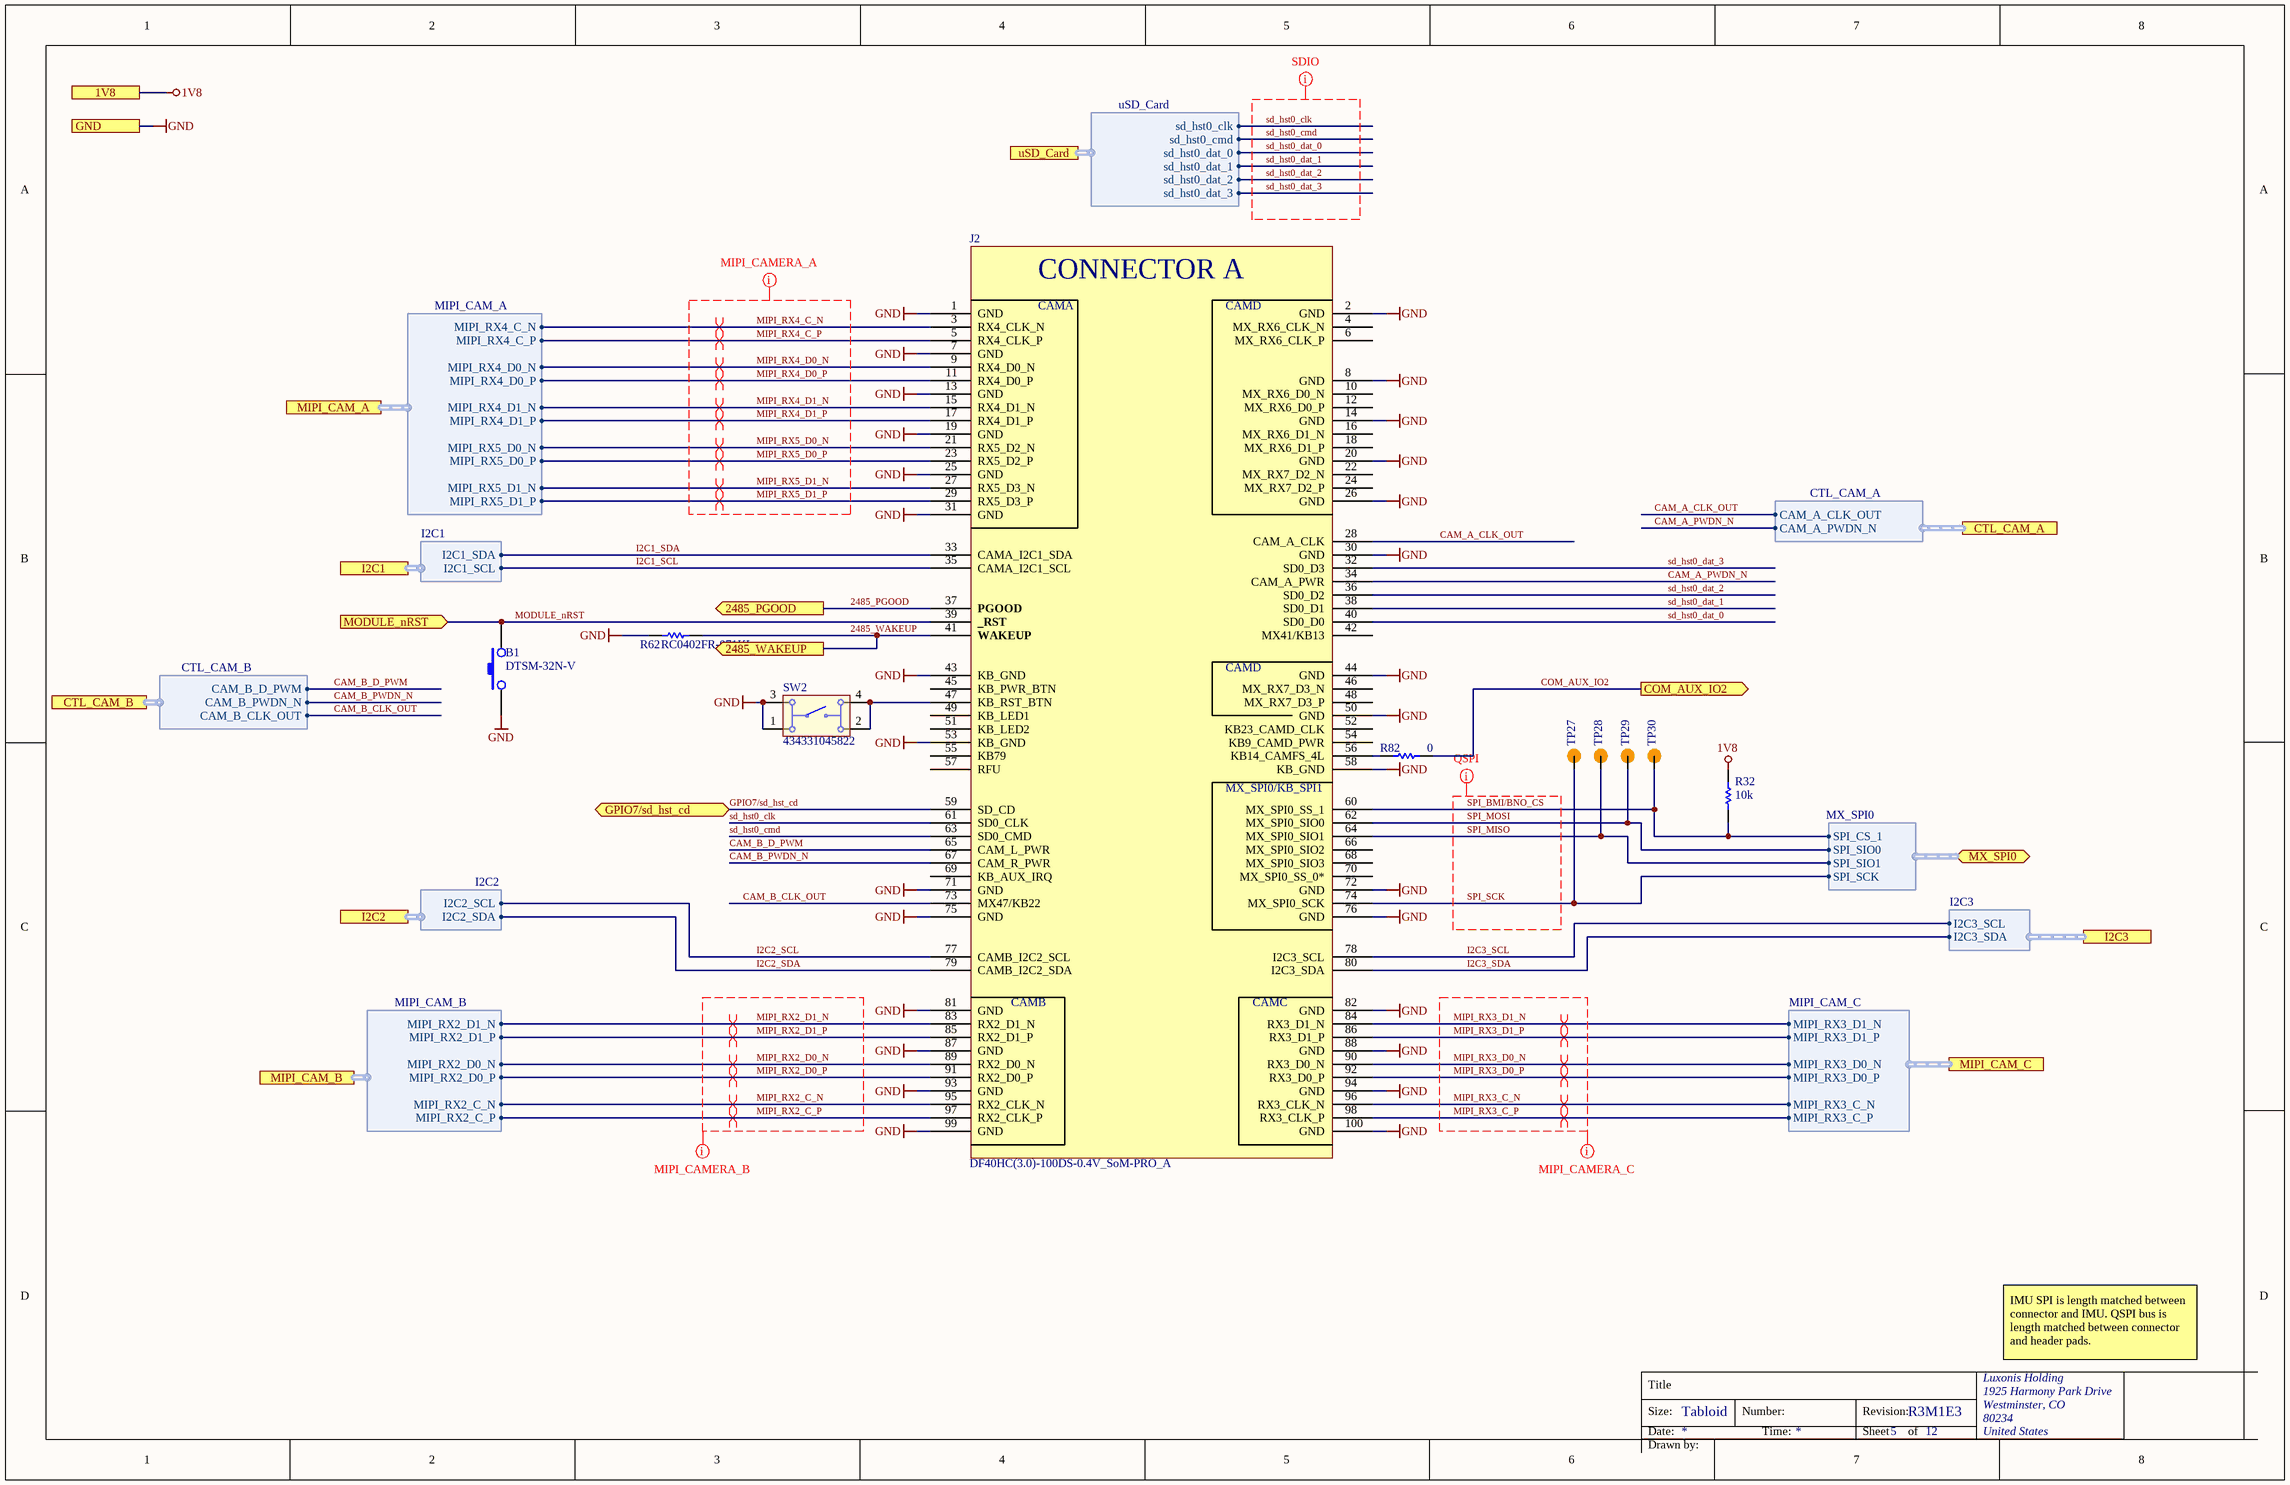
[diagram p3: CONNECTOR_A.SchDoc]

### Parts
B1  DTSM-32N-V  [DTSM-32N-V]
J2  DF40HC(3.0)-100DS-0.4V_SoM-PRO_A  [CON_A_BW2099_SoM_DF40HC-3.0-100DS-0.4V_minpad]
R32  value 10k  [RESC0402(1005)_L]  (hidden comment: RC0402FR-1310KL)
R62  RC0402FR-071KL  [RESC0402(1005)_L]
R82  value 0  [RESC0402(1005)_L]  (hidden comment: CRCW04020000Z0ED)
SW2  434331045822  [434331045822]
TP27  TEST_POINT  [TP100_200_NS]  (value not drawn)  (no BOM)
TP28  TEST_POINT  [TP100_200_NS]  (value not drawn)  (no BOM)
TP29  TEST_POINT  [TP100_200_NS]  (value not drawn)  (no BOM)
TP30  TEST_POINT  [TP100_200_NS]  (value not drawn)  (no BOM)

### Ports
1V8, 2485_PGOOD (out), 2485_WAKEUP (out), COM_AUX_IO2 (out), CTL_CAM_A (harness CTL_CAM_A), CTL_CAM_B (harness CTL_CAM_B), GND, GPIO7/sd_hst_cd (bidir), I2C1 (harness I2C1), I2C2 (harness I2C2), I2C3 (harness I2C3), MIPI_CAM_A (harness MIPI_CAM_A), MIPI_CAM_B (harness MIPI_CAM_B), MIPI_CAM_C (harness MIPI_CAM_C), MODULE_nRST (in), MX_SPI0 (bidir, harness MX_SPI0), uSD_Card (harness uSD_Card)

### Harnesses
MIPI_CAM_B: MIPI_RX2_C_P, MIPI_RX2_C_N, MIPI_RX2_D0_P, MIPI_RX2_D0_N, MIPI_RX2_D1_P, MIPI_RX2_D1_N
MIPI_CAM_A: MIPI_RX4_C_N, MIPI_RX4_C_P, MIPI_RX4_D0_N, MIPI_RX4_D0_P, MIPI_RX4_D1_N, MIPI_RX4_D1_P, MIPI_RX5_D0_N, MIPI_RX5_D0_P, MIPI_RX5_D1_N, MIPI_RX5_D1_P
MIPI_CAM_C: MIPI_RX3_C_P, MIPI_RX3_C_N, MIPI_RX3_D0_P, MIPI_RX3_D0_N, MIPI_RX3_D1_P, MIPI_RX3_D1_N
I2C2: I2C2_SDA, I2C2_SCL
I2C1: I2C1_SDA, I2C1_SCL
CTL_CAM_B: CAM_B_PWDN_N, CAM_B_D_PWM, CAM_B_CLK_OUT
I2C3: I2C3_SDA, I2C3_SCL
CTL_CAM_A: CAM_A_PWDN_N, CAM_A_CLK_OUT
uSD_Card: sd_hst0_clk, sd_hst0_cmd, sd_hst0_dat_0, sd_hst0_dat_1, sd_hst0_dat_2, sd_hst0_dat_3
MX_SPI0: SPI_SIO0, SPI_SIO1, SPI_CS_1, SPI_SCK

### Nets
1V8: R32.2 ; port 1V8
GND: B1.1 J2.1(GND) J2.2(GND) J2.7(GND) J2.8(GND) J2.13(GND) J2.14(GND) J2.19(GND) J2.20(GND) J2.25(GND) J2.26(GND) J2.30(GND) J2.31(GND) J2.43(KB_GND) J2.44(GND) J2.50(GND) J2.53(KB_GND) J2.58(KB_GND) J2.71(GND) J2.72(GND) J2.75(GND) J2.76(GND) J2.81(GND) J2.82(GND) J2.87(GND) J2.88(GND) J2.93(GND) J2.94(GND) J2.99(GND) J2.100(GND) R62.2 SW2.1 SW2.3 ; port GND
2485_PGOOD: J2.37(PGOOD) ; port 2485_PGOOD
2485_WAKEUP: J2.41(WAKEUP) R62.1 ; port 2485_WAKEUP
CAM_A_CLK_OUT: J2.28(CAM_A_CLK) ; port CTL_CAM_A.CAM_A_CLK_OUT
CAM_A_PWDN_N: J2.34(CAM_A_PWR) ; port CTL_CAM_A.CAM_A_PWDN_N
CAM_B_CLK_OUT: J2.73(MX47/KB22) ; port CTL_CAM_B.CAM_B_CLK_OUT
CAM_B_D_PWM: J2.65(CAM_L_PWR) ; port CTL_CAM_B.CAM_B_D_PWM
CAM_B_PWDN_N: J2.67(CAM_R_PWR) ; port CTL_CAM_B.CAM_B_PWDN_N
COM_AUX_IO2: R82.1 ; port COM_AUX_IO2
GPIO7/sd_hst_cd: J2.59(SD_CD) ; port GPIO7/sd_hst_cd
I2C1_SCL: J2.35(CAMA_I2C1_SCL) ; port I2C1.I2C1_SCL
I2C1_SDA: J2.33(CAMA_I2C1_SDA) ; port I2C1.I2C1_SDA
I2C2_SCL: J2.77(CAMB_I2C2_SCL) ; port I2C2.I2C2_SCL
I2C2_SDA: J2.79(CAMB_I2C2_SDA) ; port I2C2.I2C2_SDA
I2C3_SCL: J2.78(I2C3_SCL) ; port I2C3.I2C3_SCL
I2C3_SDA: J2.80(I2C3_SDA) ; port I2C3.I2C3_SDA
MIPI_RX2_C_N: J2.95(RX2_CLK_N) ; port MIPI_CAM_B.MIPI_RX2_C_N
MIPI_RX2_C_P: J2.97(RX2_CLK_P) ; port MIPI_CAM_B.MIPI_RX2_C_P
MIPI_RX2_D0_N: J2.89(RX2_D0_N) ; port MIPI_CAM_B.MIPI_RX2_D0_N
MIPI_RX2_D0_P: J2.91(RX2_D0_P) ; port MIPI_CAM_B.MIPI_RX2_D0_P
MIPI_RX2_D1_N: J2.83(RX2_D1_N) ; port MIPI_CAM_B.MIPI_RX2_D1_N
MIPI_RX2_D1_P: J2.85(RX2_D1_P) ; port MIPI_CAM_B.MIPI_RX2_D1_P
MIPI_RX3_C_N: J2.96(RX3_CLK_N) ; port MIPI_CAM_C.MIPI_RX3_C_N
MIPI_RX3_C_P: J2.98(RX3_CLK_P) ; port MIPI_CAM_C.MIPI_RX3_C_P
MIPI_RX3_D0_N: J2.90(RX3_D0_N) ; port MIPI_CAM_C.MIPI_RX3_D0_N
MIPI_RX3_D0_P: J2.92(RX3_D0_P) ; port MIPI_CAM_C.MIPI_RX3_D0_P
MIPI_RX3_D1_N: J2.84(RX3_D1_N) ; port MIPI_CAM_C.MIPI_RX3_D1_N
MIPI_RX3_D1_P: J2.86(RX3_D1_P) ; port MIPI_CAM_C.MIPI_RX3_D1_P
MIPI_RX4_C_N: J2.3(RX4_CLK_N) ; port MIPI_CAM_A.MIPI_RX4_C_N
MIPI_RX4_C_P: J2.5(RX4_CLK_P) ; port MIPI_CAM_A.MIPI_RX4_C_P
MIPI_RX4_D0_N: J2.9(RX4_D0_N) ; port MIPI_CAM_A.MIPI_RX4_D0_N
MIPI_RX4_D0_P: J2.11(RX4_D0_P) ; port MIPI_CAM_A.MIPI_RX4_D0_P
MIPI_RX4_D1_N: J2.15(RX4_D1_N) ; port MIPI_CAM_A.MIPI_RX4_D1_N
MIPI_RX4_D1_P: J2.17(RX4_D1_P) ; port MIPI_CAM_A.MIPI_RX4_D1_P
MIPI_RX5_D0_N: J2.21(RX5_D2_N) ; port MIPI_CAM_A.MIPI_RX5_D0_N
MIPI_RX5_D0_P: J2.23(RX5_D2_P) ; port MIPI_CAM_A.MIPI_RX5_D0_P
MIPI_RX5_D1_N: J2.27(RX5_D3_N) ; port MIPI_CAM_A.MIPI_RX5_D1_N
MIPI_RX5_D1_P: J2.29(RX5_D3_P) ; port MIPI_CAM_A.MIPI_RX5_D1_P
MODULE_nRST: B1.2 J2.39(_RST) ; port MODULE_nRST
sd_hst0_clk: J2.61(SD0_CLK) ; port uSD_Card.sd_hst0_clk
sd_hst0_cmd: J2.63(SD0_CMD) ; port uSD_Card.sd_hst0_cmd
sd_hst0_dat_0: J2.40(SD0_D0) ; port uSD_Card.sd_hst0_dat_0
sd_hst0_dat_1: J2.38(SD0_D1) ; port uSD_Card.sd_hst0_dat_1
sd_hst0_dat_2: J2.36(SD0_D2) ; port uSD_Card.sd_hst0_dat_2
sd_hst0_dat_3: J2.32(SD0_D3) ; port uSD_Card.sd_hst0_dat_3
SPI_BMI/BNO_CS: J2.60(MX_SPI0_SS_1) R32.1 TP30.1 ; port MX_SPI0.SPI_CS_1
SPI_MISO: J2.64(MX_SPI0_SIO1) TP28.1 ; port MX_SPI0.SPI_SIO1
SPI_MOSI: J2.62(MX_SPI0_SIO0) TP29.1 ; port MX_SPI0.SPI_SIO0
SPI_SCK: J2.74(MX_SPI0_SCK) TP27.1 ; port MX_SPI0.SPI_SCK
NetJ2_47: J2.47(KB_RST_BTN) SW2.2 SW2.4
NetJ2_56: J2.56(KB14_CAMFS_4L) R82.2

Not connected (* = marked no-connect by the designer): J2 4(MX_RX6_CLK_N) 6(MX_RX6_CLK_P) 10(MX_RX6_D0_N) 12(MX_RX6_D0_P) 16(MX_RX6_D1_N) 18(MX_RX6_D1_P) 22(MX_RX7_D2_N) 24(MX_RX7_D2_P) 42(MX41/KB13) 45(KB_PWR_BTN) 46(MX_RX7_D3_N) 48(MX_RX7_D3_P) 49(KB_LED1) 51(KB_LED2) 52(KB23_CAMD_CLK) 54(KB9_CAMD_PWR) 55(KB79) 57(RFU) 66(MX_SPI0_SIO2) 68(MX_SPI0_SIO3) 69(KB_AUX_IRQ) 70(MX_SPI0_SS_0*)

### Layout directives
differential pair; differential pair class 100ohm: MIPI_RX2_C_N, MIPI_RX2_C_P, MIPI_RX2_D0_N, MIPI_RX2_D0_P, MIPI_RX2_D1_N, MIPI_RX2_D1_P, MIPI_RX3_C_N, MIPI_RX3_C_P, MIPI_RX3_D0_N, MIPI_RX3_D0_P, MIPI_RX3_D1_N, MIPI_RX3_D1_P, MIPI_RX4_C_N, MIPI_RX4_C_P, MIPI_RX4_D0_N, MIPI_RX4_D0_P, MIPI_RX4_D1_N, MIPI_RX4_D1_P, MIPI_RX5_D0_N, MIPI_RX5_D0_P, MIPI_RX5_D1_N, MIPI_RX5_D1_P
net class MIPI_CAM_A: MIPI_RX4_C_N, MIPI_RX4_C_P, MIPI_RX4_D0_N, MIPI_RX4_D0_P, MIPI_RX4_D1_N, MIPI_RX4_D1_P, MIPI_RX5_D0_N, MIPI_RX5_D0_P, MIPI_RX5_D1_N, MIPI_RX5_D1_P
net class MIPI_CAM_C: MIPI_RX3_C_N, MIPI_RX3_C_P, MIPI_RX3_D0_N, MIPI_RX3_D0_P, MIPI_RX3_D1_N, MIPI_RX3_D1_P
net class MIPI_CAM_B: MIPI_RX2_C_N, MIPI_RX2_C_P, MIPI_RX2_D0_N, MIPI_RX2_D0_P, MIPI_RX2_D1_N, MIPI_RX2_D1_P
net class QSPI: SPI_BMI/BNO_CS, SPI_MISO, SPI_MOSI, SPI_SCK
net class SDIO: sd_hst0_clk, sd_hst0_cmd, sd_hst0_dat_0, sd_hst0_dat_1, sd_hst0_dat_2, sd_hst0_dat_3

### Notes on the sheet
- IMU SPI is length matched between connector and IMU. QSPI bus is length matched between connector and header pads.
- Title
- Size:
- Date:
- Tabloid
- Number:
- Time:
- Revision:
- Sheet
- of
- Drawn by:
- (in symbol CMP-002-00154-8) CONNECTOR A; CAMA; CAMD; MX_SPI0/KB_SPI1; CAMB; CAMC

### Library data of the parts
B1 = CMP-087-000002-2: SWITCH TACTILE SMT 3.5mm * 6mm , brown 160gf; Manufacturer 1: Diptronics; Manufacturer Part Number 1: DTSM-32N-V-T/R
J2 = CMP-002-00154-8: OAK-SoM-Pro_S2/S3 base board conn. A; Manufacturer 1: Hirose; Manufacturer Part Number 1: DF40HC(3.0)-100DS-0.4V(58); Connector Type: Receptacle; Pitch: 0.016inch; Number of Positions: 100; Gender: Female; System: Connector; Source: LuxonisMaster.SchLib; Number of Rows: 2; Stock 1: 2172; RoHS: Yes; Contact Plating: Gold; Mounting Technology: SMT; ComponentLink2Description: https://datasheet.ciiva.com/18562/ed-df40-20140305-18562189.pdf?src-supplier=Digi-Key; ComponentLink4Description: https://datasheet.ciiva.com/18562/ed-df40-20140305-18562462.pdf?src-supplier=Digi-Key; ComponentLink1Description: https://datasheet.ciiva.com/46636/ed-df40-20140305-46636517.pdf?src-supplier=Digi-Key; ComponentLink3Description: https://datasheet.ciiva.com/13559/ed-df40-20140305-13559540.pdf?src-supplier=Mouser; Stock 2: 2078; ComponentLink3URL: https://datasheet.ciiva.com/13559/ed-df40-20140305-13559540.pdf?src-supplier=Mouser; Mount: Surface Mount; Pricing 2: 1=2.50000, 10=2.40000, 25=2.10000, 50=2.10000, 100=2.00000, 250=1.76000, 500=1.71000, 1000=1.45000, 2000=1.36000, 5000=1.31000, 10000=1.31000 (USD); Pins: 100; ComponentLink4URL: https://datasheet.ciiva.com/18562/ed-df40-20140305-18562462.pdf?src-supplier=Digi-Key; Pricing 1: 1=2.54000, 10=2.26000, 25=2.07000, 50=2.07000, 100=1.98000, 250=1.79000, 500=1.65000, 1000=1.41000, 3000=1.32000, 6000=1.23000, 10000=1.23000 (USD); Packaging: Tape and Reel; Lead Free: Lead Free; Package Quantity: 1000; Design Item ID: DF40HC(3.0)-100DS-0.4V_SoM-PRO_A; ComponentLink1URL: https://datasheet.ciiva.com/46636/ed-df40-20140305-46636517.pdf?src-supplier=Digi-Key; ComponentLink2URL: https://datasheet.ciiva.com/18562/ed-df40-20140305-18562189.pdf?src-supplier=Digi-Key
R32 = CMP-115-000004-8: as R79 on sheet CONNECTOR_B; Manufacturer Part Number 1: RC0402FR-1310KL; Case/Package: 0402; Min Operating Temperature: -55°C; Max Operating Temperature: 155°C; Tolerance: 1%; Design Item ID: RC0402FR-1310KL
R62 = CMP-013-000004-9: RES SMD 1K OHM 1% 1/16W 0402; Manufacturer 1: Yageo; Power Rating: 62.5mW; Voltage Rating: 50V; Min Operating Temperature: -55°C; Max Operating Temperature: 155°C; Manufacturer Part Number 1: RC0402FR-071KL; Case/Package: 0402; Tolerance: 1%; Design Item ID: RC0402FR-071KL; Value: 1k
R82 = CMP-013-000022-11: as R27 on sheet CONNECTOR_B; Manufacturer Part Number 1: CRCW04020000Z0ED; Case/Package: 0402; Min Operating Temperature: -55°C; Max Operating Temperature: 155°C; Tolerance: 5%; Design Item ID: CRCW04020000Z0ED
SW2 = CMP-011-00016-3: as SW1 on sheet CONNECTOR_B; Supplier Part Number 1: 732-7055-2-ND; Manufacturer part number 1: 434331045822; Pins: 4; Supplier 1: Digi-Key; Current Rating: 50mA; Mounting Technology: SMD; Case/Package: 434331045822
TP27-TP30 = CMP-015-000000-2: Manufacturer Part Number 1: /; Design Item ID: TEST_POINT; Source: LuxonisMaster.SchLib

## Sheet ETH_PCIE_PHY.SchDoc: =project_title
size Tabloid; CompanyName: Luxonis Holding; DrawnBy: Boris Chou / Blaz Kvas; Organization: Luxonis Holding; Address1: 1925 Harmony Park Drive; Address2: Westminster, CO; Address3: 80234; Address4: United States; DocumentNumber: D2088000; Revision: R3M1E3; SheetNumber: 7; SheetTotal: 12
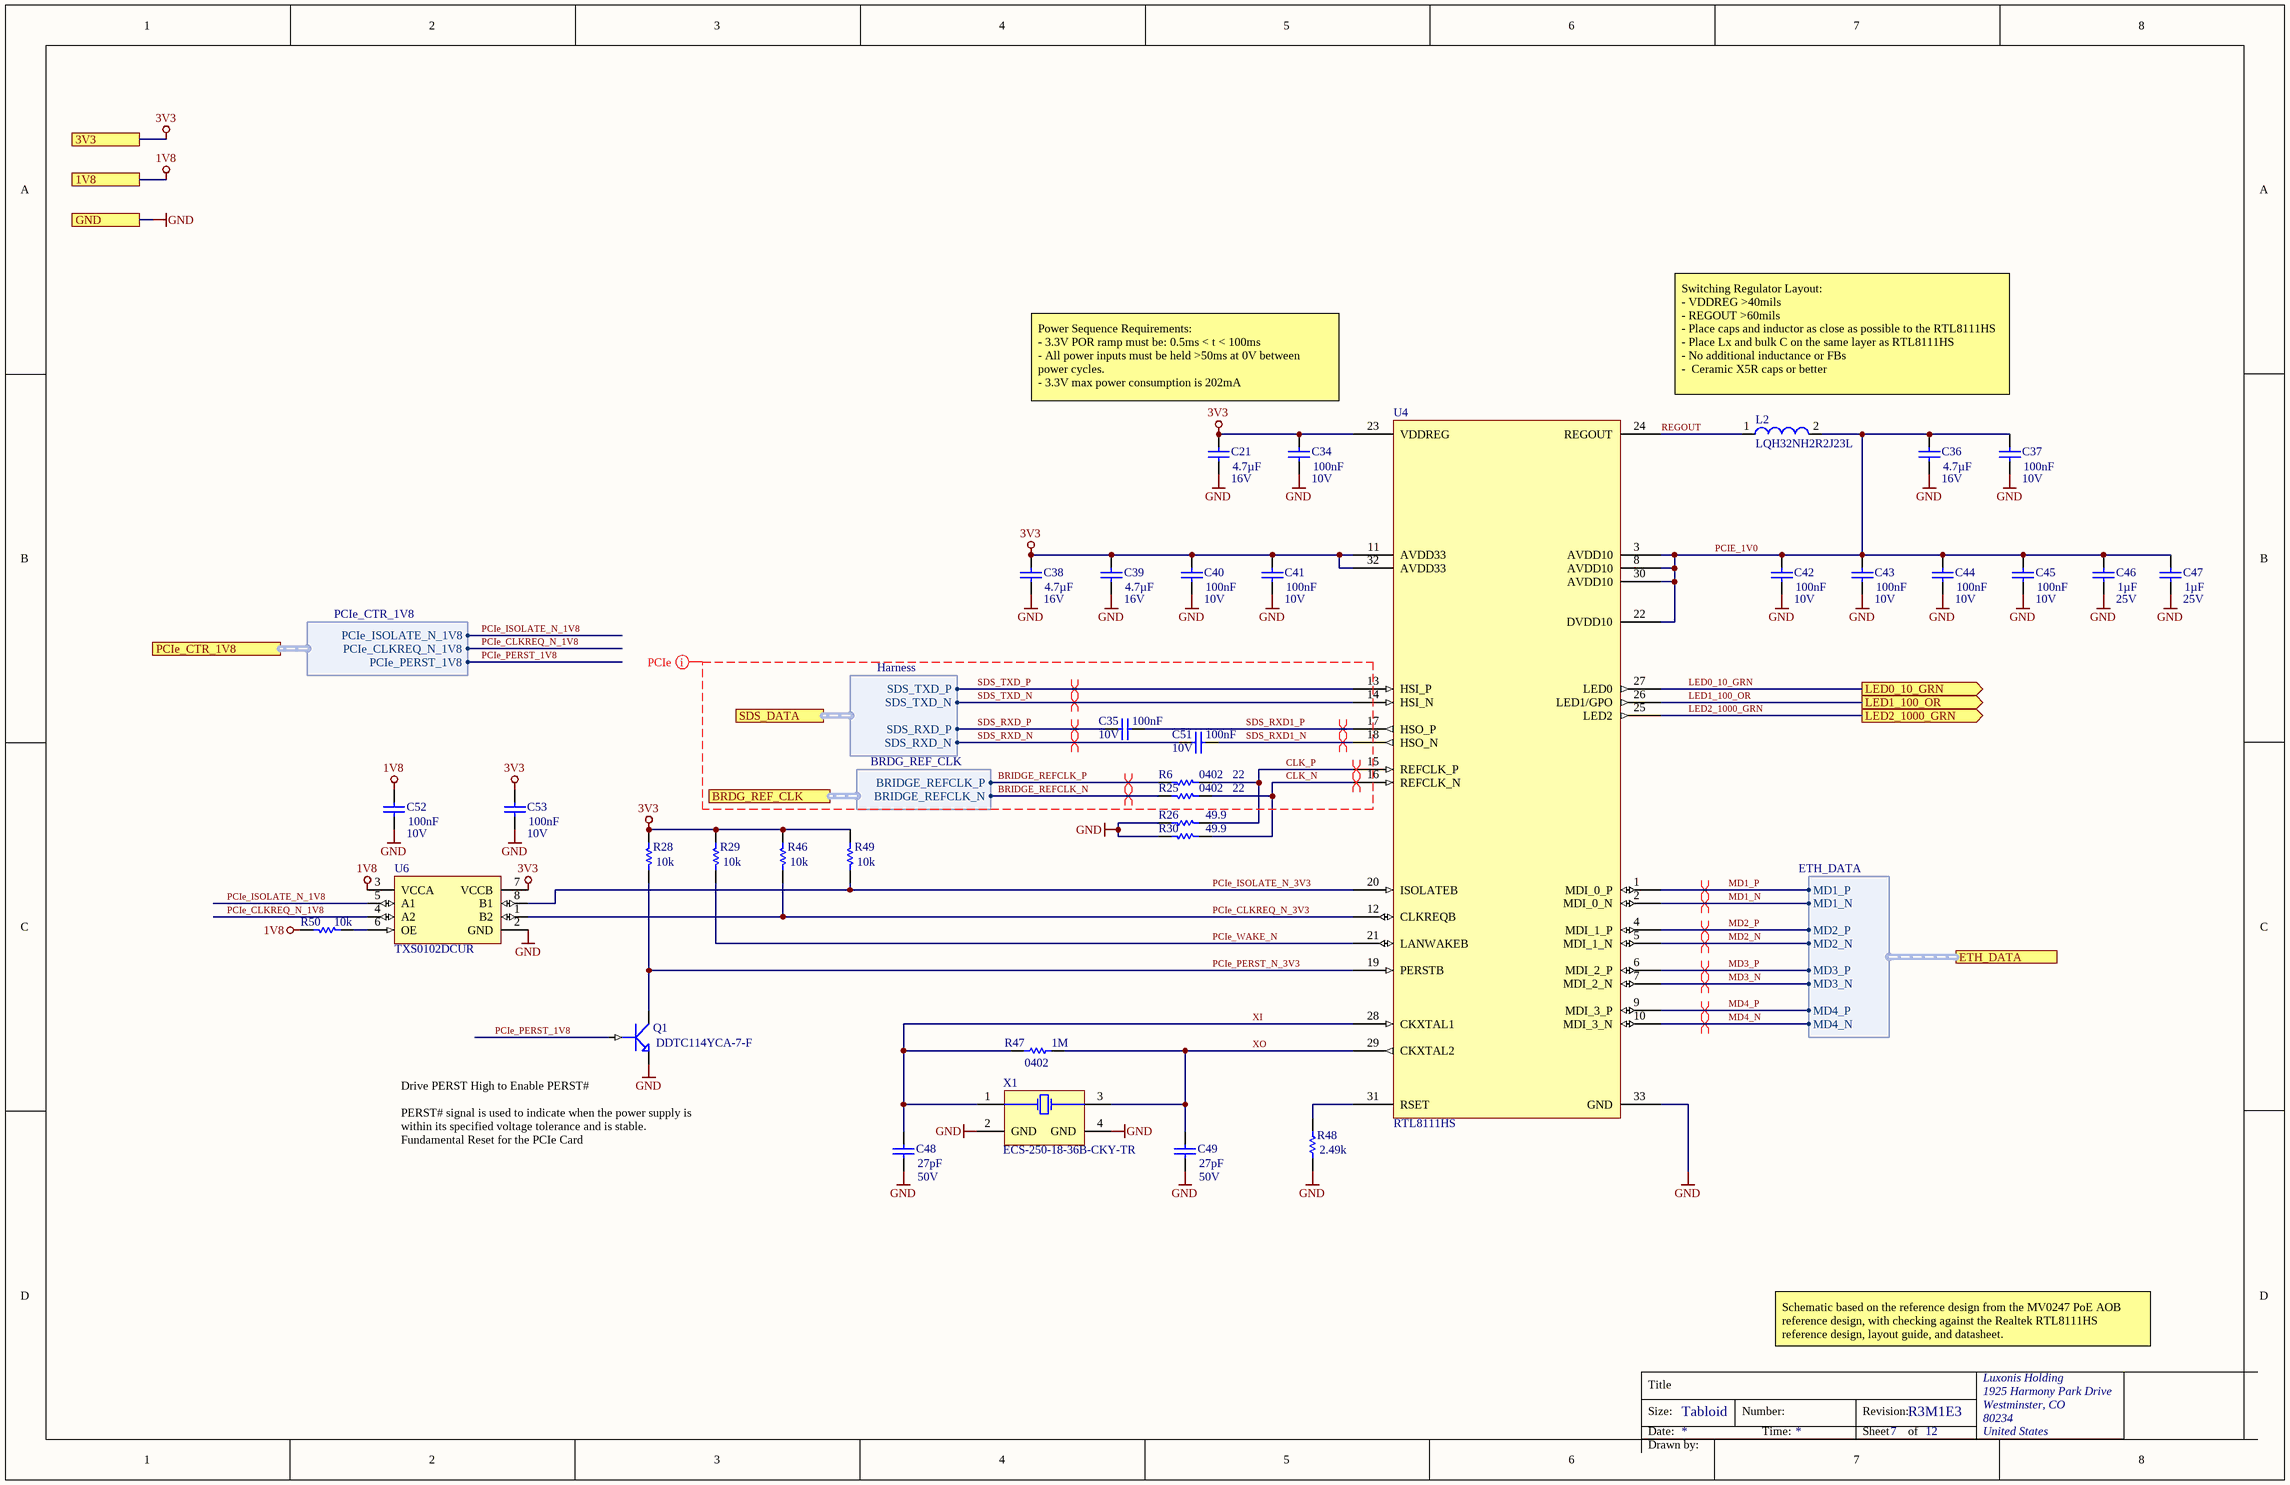
[diagram p4: ETH_PCIE_PHY.SchDoc]

### Parts
C21  value 4.7µF  Voltage Rating: 16V  [CAPC0603(1608)100_N]  (hidden comment: GRM188R61C475KAAJD)
C34  value 100nF  Voltage Rating: 10V  [CAPC0402(1005)70_N]  (hidden comment: GRM155R71A104JA01D)
C35  value 100nF  Voltage Rating: 10V  [CAPC0201(0603)33_L]  (hidden comment: GRM033R61A104KE15D)
C36  value 4.7µF  Voltage Rating: 16V  [CAPC0603(1608)100_N]  (hidden comment: GRM188R61C475KAAJD)
C37  value 100nF  Voltage Rating: 10V  [CAPC0402(1005)70_N]  (hidden comment: GRM155R71A104JA01D)
C38  value 4.7µF  Voltage Rating: 16V  [CAPC0603(1608)100_N]  (hidden comment: GRM188R61C475KAAJD)
C39  value 4.7µF  Voltage Rating: 16V  [CAPC0603(1608)100_N]  (hidden comment: GRM188R61C475KAAJD)
C40  value 100nF  Voltage Rating: 10V  [CAPC0402(1005)70_N]  (hidden comment: GRM155R71A104JA01D)
C41  value 100nF  Voltage Rating: 10V  [CAPC0402(1005)70_N]  (hidden comment: GRM155R71A104JA01D)
C42  value 100nF  Voltage Rating: 10V  [CAPC0402(1005)70_N]  (hidden comment: GRM155R71A104JA01D)
C43  value 100nF  Voltage Rating: 10V  [CAPC0402(1005)70_N]  (hidden comment: GRM155R71A104JA01D)
C44  value 100nF  Voltage Rating: 10V  [CAPC0402(1005)70_N]  (hidden comment: GRM155R71A104JA01D)
C45  value 100nF  Voltage Rating: 10V  [CAPC0402(1005)70_N]  (hidden comment: GRM155R71A104JA01D)
C46  value 1µF  Voltage Rating: 25V  [CAPC0402(1005)70_N]  (hidden comment: GRM155R61E105KA12D)
C47  value 1µF  Voltage Rating: 25V  [CAPC0402(1005)70_N]  (hidden comment: GRM155R61E105KA12D)
C48  value 27pF  Voltage Rating: 50V  [CAPC0402(1005)60_N]  (hidden comment: C0402C270J5GACTU)
C49  value 27pF  Voltage Rating: 50V  [CAPC0402(1005)60_N]  (hidden comment: C0402C270J5GACTU)
C51  value 100nF  Voltage Rating: 10V  [CAPC0201(0603)33_L]  (hidden comment: GRM033R61A104KE15D)
C52  value 100nF  Voltage Rating: 10V  [CAPC0402(1005)70_N]  (hidden comment: GRM155R71A104JA01D)
C53  value 100nF  Voltage Rating: 10V  [CAPC0402(1005)70_N]  (hidden comment: GRM155R71A104JA01D)
L2  LQH32NH2R2J23L  [LQH32NH2R2J23L]
Q1  DDTC114YCA-7-F  [DDTC114YCA-7-F-Footprint-1]
R6  value 22  Case/Package: 0402  [RESC0402(1005)_L]  (hidden comment: RC0402FR-0722RL)
R25  value 22  Case/Package: 0402  [RESC0402(1005)_L]  (hidden comment: RC0402FR-0722RL)
R26  value 49.9  [RESC0402(1005)_L]  (hidden comment: RC0402FR-0749R9L)
R28  value 10k  [RESC0402(1005)_N]  (hidden comment: RC0402FR-1310KL)
R29  value 10k  [RESC0402(1005)_N]  (hidden comment: RC0402FR-1310KL)
R30  value 49.9  [RESC0402(1005)_L]  (hidden comment: RC0402FR-0749R9L)
R46  value 10k  [RESC0402(1005)_N]  (hidden comment: RC0402FR-1310KL)
R47  value 1M  Case/Package: 0402  [RESC0402(1005)_N]  (hidden comment: RC0402FR-071ML)
R48  value 2.49k  [RESC0402(1005)_N]  (hidden comment: RC0402FR-072K49L)
R49  value 10k  [RESC0402(1005)_N]  (hidden comment: RC0402FR-1310KL)
R50  value 10k  [RESC0402(1005)_N]  (hidden comment: RC0402FR-1310KL)
U4  RTL8111HS  [RTL8111Hx-CG]
U6  TXS0102DCUR  [TXS0102DCUR]
X1  ECS-250-18-36B-CKY-TR  [ECS-250-18-36B-CKY-TR]

### Ports
1V8, 3V3, BRDG_REF_CLK (harness BRDG_REF_CLK), ETH_DATA (harness ETH_DATA), GND, LED0_10_GRN (out), LED1_100_OR (out), LED2_1000_GRN (out), PCIe_CTR_1V8 (harness PCIe_CTR_1V8), SDS_DATA (harness Harness)

### Harnesses
ETH_DATA: MD1_P, MD1_N, MD2_P, MD2_N, MD3_P, MD3_N, MD4_P, MD4_N
Harness: SDS_TXD_P, SDS_TXD_N, SDS_RXD_P, SDS_RXD_N
BRDG_REF_CLK: BRIDGE_REFCLK_P, BRIDGE_REFCLK_N
PCIe_CTR_1V8: PCIe_CLKREQ_N_1V8, PCIe_ISOLATE_N_1V8, PCIe_PERST_1V8

### Nets
1V8: C52.2 R50.2 U6.3(VCCA) ; port 1V8
3V3: C21.2 C34.2 C38.2 C39.2 C40.2 C41.2 C53.2 R28.1 R29.1 R46.1 R49.1 U4.11(AVDD33) U4.23(VDDREG) U4.32(AVDD33) U6.7(VCCB) ; port 3V3
GND: C21.1 C34.1 C36.1 C37.1 C38.1 C39.1 C40.1 C41.1 C42.1 C43.1 C44.1 C45.1 C46.1 C47.1 C48.1 C49.1 C52.1 C53.1 Q1.2(E) R26.1 R30.1 R48.1 U4.33(GND) U6.2(GND) X1.2(GND) X1.4(GND) ; port GND
BRIDGE_REFCLK_N: R25.2 ; port BRDG_REF_CLK.BRIDGE_REFCLK_N
BRIDGE_REFCLK_P: R6.2 ; port BRDG_REF_CLK.BRIDGE_REFCLK_P
CLK_N: R25.1 R30.2 U4.16(REFCLK_N)
CLK_P: R6.1 R26.2 U4.15(REFCLK_P)
LED0_10_GRN: U4.27(LED0) ; port LED0_10_GRN
LED1_100_OR: U4.26(LED1/GPO) ; port LED1_100_OR
LED2_1000_GRN: U4.25(LED2) ; port LED2_1000_GRN
MD1_N: U4.2(MDI_0_N) ; port ETH_DATA.MD1_N
MD1_P: U4.1(MDI_0_P) ; port ETH_DATA.MD1_P
MD2_N: U4.5(MDI_1_N) ; port ETH_DATA.MD2_N
MD2_P: U4.4(MDI_1_P) ; port ETH_DATA.MD2_P
MD3_N: U4.7(MDI_2_N) ; port ETH_DATA.MD3_N
MD3_P: U4.6(MDI_2_P) ; port ETH_DATA.MD3_P
MD4_N: U4.10(MDI_3_N) ; port ETH_DATA.MD4_N
MD4_P: U4.9(MDI_3_P) ; port ETH_DATA.MD4_P
PCIE_1V0: C36.2 C37.2 C42.2 C43.2 C44.2 C45.2 C46.2 C47.2 L2.2 U4.3(AVDD10) U4.8(AVDD10) U4.22(DVDD10) U4.30(AVDD10)
PCIe_CLKREQ_N_1V8: U6.4(A2) ; port PCIe_CTR_1V8.PCIe_CLKREQ_N_1V8
PCIe_CLKREQ_N_3V3: R46.2 U4.12(CLKREQB) U6.1(B2)
PCIe_ISOLATE_N_1V8: U6.5(A1) ; port PCIe_CTR_1V8.PCIe_ISOLATE_N_1V8
PCIe_ISOLATE_N_3V3: R49.2 U4.20(ISOLATEB) U6.8(B1)
PCIe_PERST_1V8: Q1.1(B) ; port PCIe_CTR_1V8.PCIe_PERST_1V8
PCIe_PERST_N_3V3: Q1.3(C) R28.2 U4.19(PERSTB)
PCIe_WAKE_N: R29.2 U4.21(LANWAKEB)
REGOUT: L2.1 U4.24(REGOUT)
SDS_RXD1_N: C51.2 U4.18(HSO_N)
SDS_RXD1_P: C35.2 U4.17(HSO_P)
SDS_RXD_N: C51.1 ; port SDS_DATA.SDS_RXD_N
SDS_RXD_P: C35.1 ; port SDS_DATA.SDS_RXD_P
SDS_TXD_N: U4.14(HSI_N) ; port SDS_DATA.SDS_TXD_N
SDS_TXD_P: U4.13(HSI_P) ; port SDS_DATA.SDS_TXD_P
XI: C48.2 R47.1 U4.28(CKXTAL1) X1.1(X1)
XO: C49.2 R47.2 U4.29(CKXTAL2) X1.3(X2)
NetR48_2: R48.2 U4.31(RSET)
NetR50_1: R50.1 U6.6(OE)

### Layout directives
differential pair; net class ETH; differential pair class 100ohm: MD1_N, MD1_P, MD2_N, MD2_P, MD3_N, MD3_P, MD4_N, MD4_P
differential pair; differential pair class 100ohm: BRIDGE_REFCLK_N, BRIDGE_REFCLK_P, CLK_N, CLK_P, SDS_RXD1_N, SDS_RXD1_P, SDS_RXD_N, SDS_RXD_P, SDS_TXD_N, SDS_TXD_P
net class PCIe: BRIDGE_REFCLK_N, BRIDGE_REFCLK_P, CLK_N, CLK_P, SDS_RXD1_N, SDS_RXD1_P, SDS_RXD_N, SDS_RXD_P, SDS_TXD_N, SDS_TXD_P

### Notes on the sheet
- Power Sequence Requirements:
  - 3.3V POR ramp must be: 0.5ms < t < 100ms
  - All power inputs must be held >50ms at 0V between power cycles.
  - 3.3V max power consumption is 202mA
- Switching Regulator Layout:
  - VDDREG >40mils
  - REGOUT >60mils
  - Place caps and inductor as close as possible to the RTL8111HS
  - Place Lx and bulk C on the same layer as RTL8111HS
  - No additional inductance or FBs
  -  Ceramic X5R caps or better
- (near Q1) Drive PERST High to Enable PERST#
- PERST# signal is used to indicate when the power supply is within its specified voltage tolerance and is stable.
  Fundamental Reset for the PCIe Card
- Schematic based on the reference design from the MV0247 PoE AOB reference design, with checking against the Realtek RTL8111HS reference design, layout guide, and datasheet.
- Title
- Size:
- Date:
- Tabloid
- Number:
- Time:
- Revision:
- Sheet
- of
- Drawn by:

### Library data of the parts
C21 C36 C38 C39 = CMP-004-000020-4: CAP CER 4.7UF 16V X5R 0603 10%; Manufacturer 1: Murata; Manufacturer Part Number 1: GRM188R61C475KAAJD; Case/Package: 0603; Min Operating Temperature: -55°C; Max Operating Temperature: 85°C; Tolerance: 10%; Dielectric: X5R; Length: 1.6mm; Height: 0.8mm; Width: 0.8mm; Depth: 0.8mm; ComponentLink1URL: https://datasheet.ciiva.com/14813/595grm188r61c475kaaj23-14813668.pdf?src-supplier=Arrow; ComponentLink1Description: https://datasheet.ciiva.com/14813/595grm188r61c475kaaj23-14813668.pdf?src-supplier=Arrow; Manufacturer 2: Murata; Manufacturer Part Number 2: GRM188R61C475KAAJD; Manufacturer 3: Murata; Manufacturer Part Number 3: GRM188R61C475KAAJD; Design Item ID: GRM188R61C475KAAJD; Mounting Technology: SMT
C34 C37 C40-C45 C52 C53 = CMP-108-000015-5: CAP CER 0.1UF 10V X7R 0402 5%; Manufacturer 1: Murata; Manufacturer Part Number 1: GRM155R71A104JA01D; Case/Package: 0402; Min Operating Temperature: -55°C; Max Operating Temperature: 125°C; Tolerance: 5%; Dielectric: X7R; Length: 1mm; Height: 0.5mm; Width: 0.02inch; Depth: 0.5mm; ComponentLink1URL: https://datasheet.ciiva.com/5411/product-5411135.pdf?src-supplier=Mouser; ComponentLink1Description: https://datasheet.ciiva.com/5411/product-5411135.pdf?src-supplier=Mouser; ComponentLink2URL: https://datasheet.ciiva.com/11618/c02e-11618821.pdf?src-supplier=Avnet; ComponentLink2Description: https://datasheet.ciiva.com/11618/c02e-11618821.pdf?src-supplier=Avnet; Design Item ID: GRM155R71A104JA01D; Mounting Technology: SMT
C35 C51 = CMP-004-000007-6: CAP CER 0.1UF 10V X5R 0201 10%; Manufacturer 1: Murata; Manufacturer Part Number 1: GRM033R61A104KE15D; Case/Package: 0201; Min Operating Temperature: -55°C; Max Operating Temperature: 85°C; Tolerance: 10%; Dielectric: X5R; Length: 0.6mm; Height: 0.3mm; Width: 0.012inch; Depth: 0.3mm; ComponentLink1URL: https://datasheet.ciiva.com/26843/getdatasheetpartid-308656-26843739.pdf?src-supplier=Verical; ComponentLink1Description: https://datasheet.ciiva.com/26843/getdatasheetpartid-308656-26843739.pdf?src-supplier=Verical; ComponentLink2URL: https://datasheet.ciiva.com/5413/product-5413117.pdf?src-supplier=Mouser; ComponentLink2Description: https://datasheet.ciiva.com/5413/product-5413117.pdf?src-supplier=Mouser; ComponentLink3URL: https://datasheet.ciiva.com/6256/partnumbering-e-01-6256406.pdf?src-supplier=Digi-Key; ComponentLink3Description: https://datasheet.ciiva.com/6256/partnumbering-e-01-6256406.pdf?src-supplier=Digi-Key; ComponentLink4URL: https://datasheet.ciiva.com/6256/partnumbering-e-01-6256407.pdf?src-supplier=Digi-Key; ComponentLink4Description: https://datasheet.ciiva.com/6256/partnumbering-e-01-6256407.pdf?src-supplier=Digi-Key; ComponentLink5URL: https://datasheet.ciiva.com/6256/partnumbering-e-01-6256408.pdf?src-supplier=Digi-Key; ComponentLink5Description: https://datasheet.ciiva.com/6256/partnumbering-e-01-6256408.pdf?src-supplier=Digi-Key; Design Item ID: GRM033R61A104KE15D; Mounting Technology: SMT
C46 C47 = CMP-108-000014-5: CAP CER 1UF 25V X5R 0402 10%; Manufacturer 1: Murata; Manufacturer Part Number 1: GRM155R61E105KA12D; Case/Package: 0402; Min Operating Temperature: -55°C; Max Operating Temperature: 85°C; Tolerance: 10%; Dielectric: X5R; Length: 1mm; Height: 0.5mm; Width: 0.5mm; Depth: 0.5mm; ComponentLink1URL: https://datasheet.ciiva.com/22732/1666664-22732122.pdf?src-supplier=Element14; ComponentLink1Description: https://datasheet.ciiva.com/22732/1666664-22732122.pdf?src-supplier=Element14; ComponentLink2URL: https://datasheet.ciiva.com/7719/1666664-7719006.pdf?src-supplier=Element14; ComponentLink2Description: https://datasheet.ciiva.com/7719/1666664-7719006.pdf?src-supplier=Element14; Design Item ID: GRM155R61E105KA12D; Mounting Technology: SMT
C48 C49 = CMP-108-000006-6: CAP CER 27PF 50V C0G 0402 5%; Manufacturer 1: KEMET; Manufacturer Part Number 1: C0402C270J5GACTU; Case/Package: 0402; Min Operating Temperature: -55°C; Max Operating Temperature: 125°C; Tolerance: 5%; Dielectric: C0G; Length: 1mm; Height: 0.5mm; Width: 0.5mm; Depth: 0.5mm; ComponentLink1URL: https://datasheet.ciiva.com/144/docfinderpartnumber-c0402c270j5gactu-144118.pdf?src-supplier=Digi-Key; ComponentLink1Description: https://datasheet.ciiva.com/144/docfinderpartnumber-c0402c270j5gactu-144118.pdf?src-supplier=Digi-Key; ComponentLink2URL: https://datasheet.ciiva.com/7747/kem-c1003-c0g-smd-7747509.pdf?src-supplier=Element14; ComponentLink2Description: https://datasheet.ciiva.com/7747/kem-c1003-c0g-smd-7747509.pdf?src-supplier=Element14; ComponentLink3URL: https://datasheet.ciiva.com/26847/getdatasheetpartid-408632-26847386.pdf?src-supplier=Verical; ComponentLink3Description: https://datasheet.ciiva.com/26847/getdatasheetpartid-408632-26847386.pdf?src-supplier=Verical; ComponentLink4URL: https://datasheet.ciiva.com/7392/1372242-7392237.pdf?src-supplier=Newark; ComponentLink4Description: https://datasheet.ciiva.com/7392/1372242-7392237.pdf?src-supplier=Newark; ComponentLink5URL: https://datasheet.ciiva.com/14586/70095383-14586671.pdf?src-supplier=Allied+Electronics; ComponentLink5Description: https://datasheet.ciiva.com/14586/70095383-14586671.pdf?src-supplier=Allied+Electronics; Design Item ID: C0402C270J5GACTU; Mounting Technology: SMT
L2 = CMP-112-000003-2: FIXED IND 2.2UH 610MA 97MOHM SMD; Manufacturer 1: Murata; Tolerance: 5%; Self Resonant Frequency: 75MHz; Value: 2.2µH; Manufacturer Part Number 1: LQH32NH2R2J23L; Case/Package: Nonstandard; Current Rating: 610mA
Q1 = CMP-074-000000-4: TRANS PREBIAS NPN 200MW SOT23-3; Manufacturer 1: Diodes; Continuous Drain Current: 100mA; Max Drain to Source Voltage: 50V; Manufacturer Part Number 1: DDTC114YCA-7-F; Case/Package: SOT-23-3; Design Item ID: DDTC114YCA-7-F
R6 R25 = CMP-013-000012-8: RES SMD 22 OHM 1% 1/16W 0402; Manufacturer 1: Yageo; Power Rating: 62.5mW; Manufacturer Part Number 1: RC0402FR-0722RL; Min Operating Temperature: -55°C; Max Operating Temperature: 155°C; Tolerance: 1%; Design Item ID: RC0402FR-0722RL
R26 R30 = CMP-115-000016-6: RES SMD 49.9 OHM 1% 1/16W 0402; Manufacturer 1: Yageo; Power Rating: 62.5mW; Temperature Coefficient: 100ppm/°C; Voltage Rating: 50V; Manufacturer Part Number 1: RC0402FR-0749R9L; Case/Package: 0402; Min Operating Temperature: -55°C; Max Operating Temperature: 155°C; Tolerance: 1%; Design Item ID: RC0402FR-0749R9L
R28 R29 R46 R49 R50 = CMP-115-000004-8: as R79 on sheet CONNECTOR_B; Manufacturer Part Number 1: RC0402FR-1310KL; Case/Package: 0402; Min Operating Temperature: -55°C; Max Operating Temperature: 155°C; Tolerance: 1%; Design Item ID: RC0402FR-1310KL
R47 = CMP-013-000005-8: RES SMD 1M OHM 1% 1/16W 0402; Manufacturer 1: Yageo; Power Rating: 63mW; Voltage Rating: 50V; Manufacturer Part Number 1: RC0402FR-071ML; Min Operating Temperature: -55°C; Max Operating Temperature: 155°C; Tolerance: 1%; Design Item ID: RC0402FR-071ML
R48 = CMP-115-000015-6: RES SMD 2.49K OHM 1% 1/16W 0402; Manufacturer 1: Yageo; Temperature Coefficient: 100ppm/°C; Power Rating: 62.5mW; Voltage Rating: 50V; Manufacturer Part Number 1: RC0402FR-072K49L; Case/Package: 0402; Min Operating Temperature: -55°C; Max Operating Temperature: 155°C; Tolerance: 1%; Design Item ID: RC0402FR-072K49L
U4 = CMP-113-000000-3: IC ETHERNET/PCIe PHY Realtek; Manufacturer Part Number 1: RTL8111HS-CG; Manufacturer 1: Realtek
U6 = CMP-113-000005-2: TEXAS INSTRUMENTS - TXS0102DCUR - IC, TRANSLATOR, 2 BIT, BI, US-8; Min Supply Voltage: 1.65V; Max Supply Voltage: 5.5V; Max Output Current: 1A; Manufacturer 1: Texas Instruments; Manufacturer Part Number 1: TXS0102DCUR; Case/Package: VSSOP; Min Operating Temperature: -40°C; Max Operating Temperature: 85°C; Pins: 8
X1 = CMP-006-000002-2: CRYSTAL 25.0000MHZ 18PF SMD 25MHz ±10ppm Crystal 18pF 50 Ohms 4-SMD, No Lead; Manufacturer 1: ECS International; Manufacturer Part Number 1: ECS-250-18-36B-CKY-TR; Frequency: 25MHz